# EAGLE board core (EAGLE 9.4.2), part 1 of 6
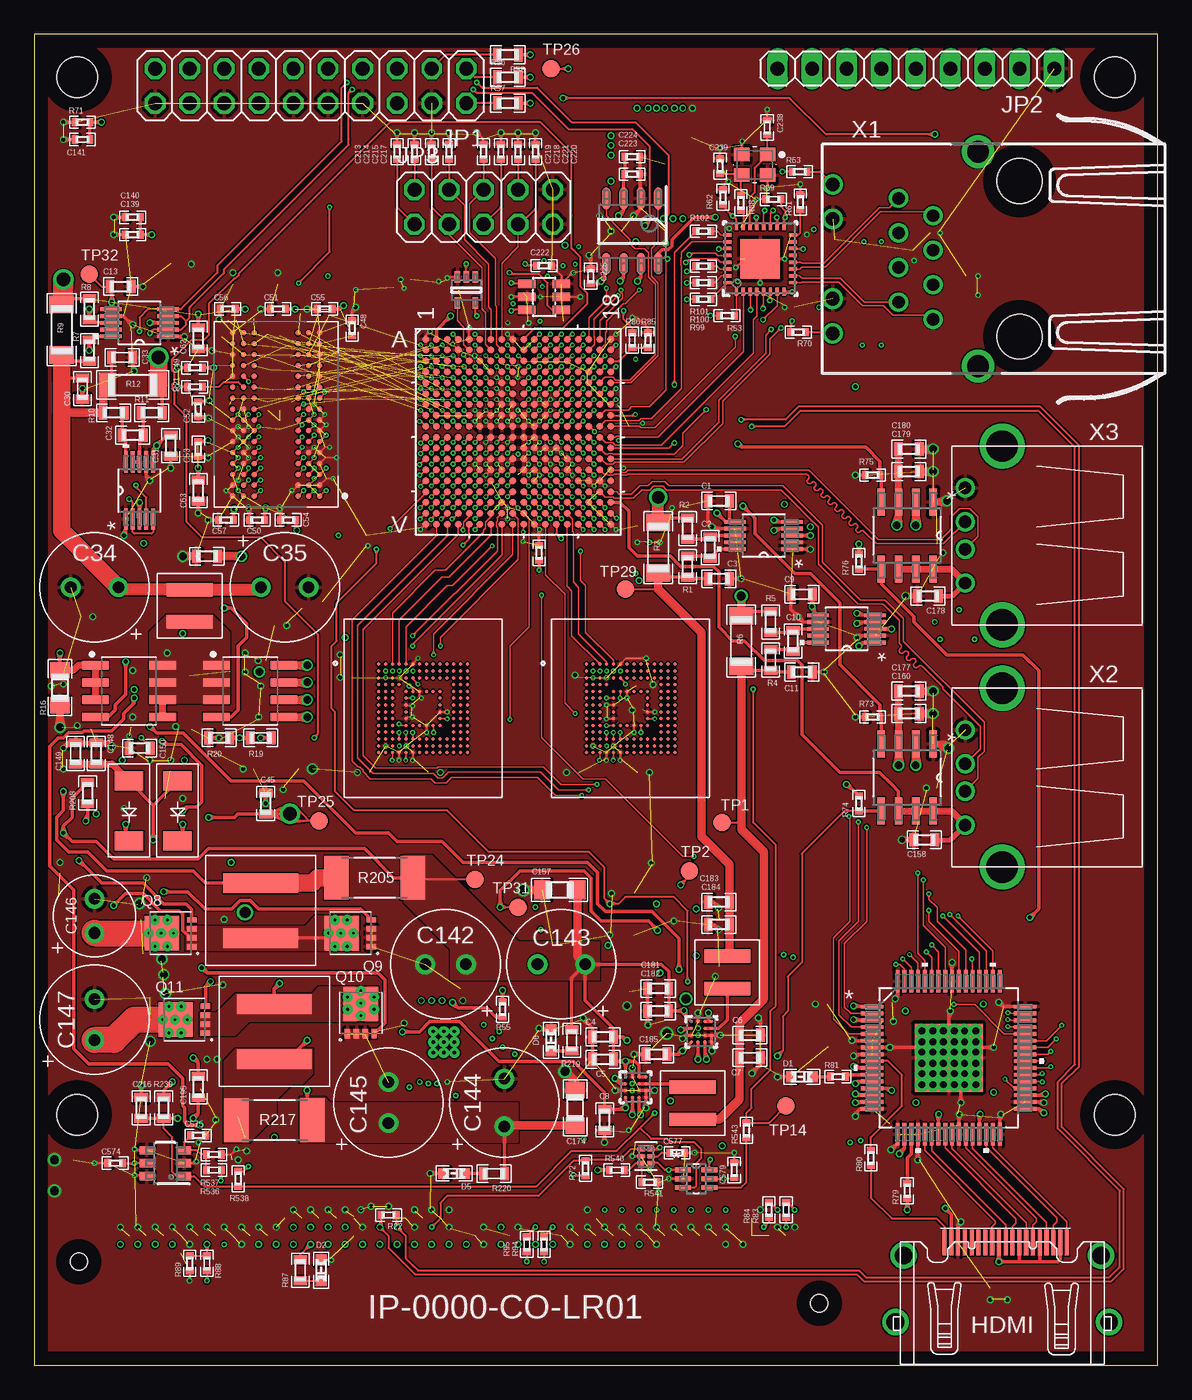
[diagram p16: board, top side]
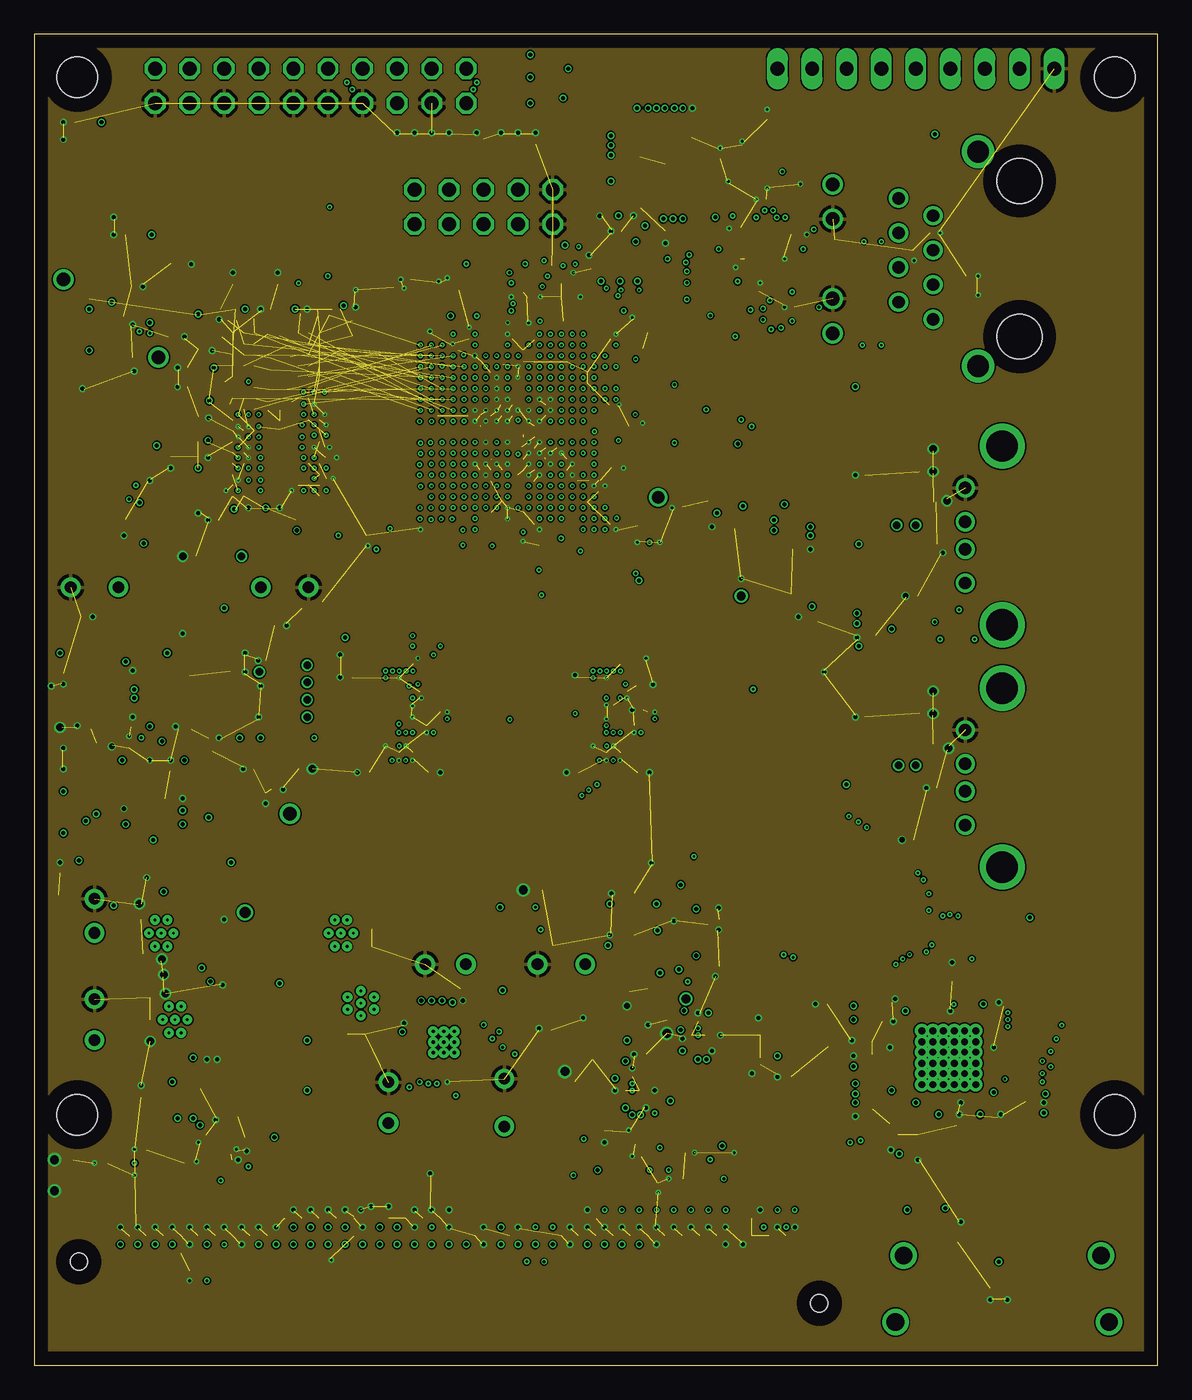
[diagram p17: board, inner layer Route2]
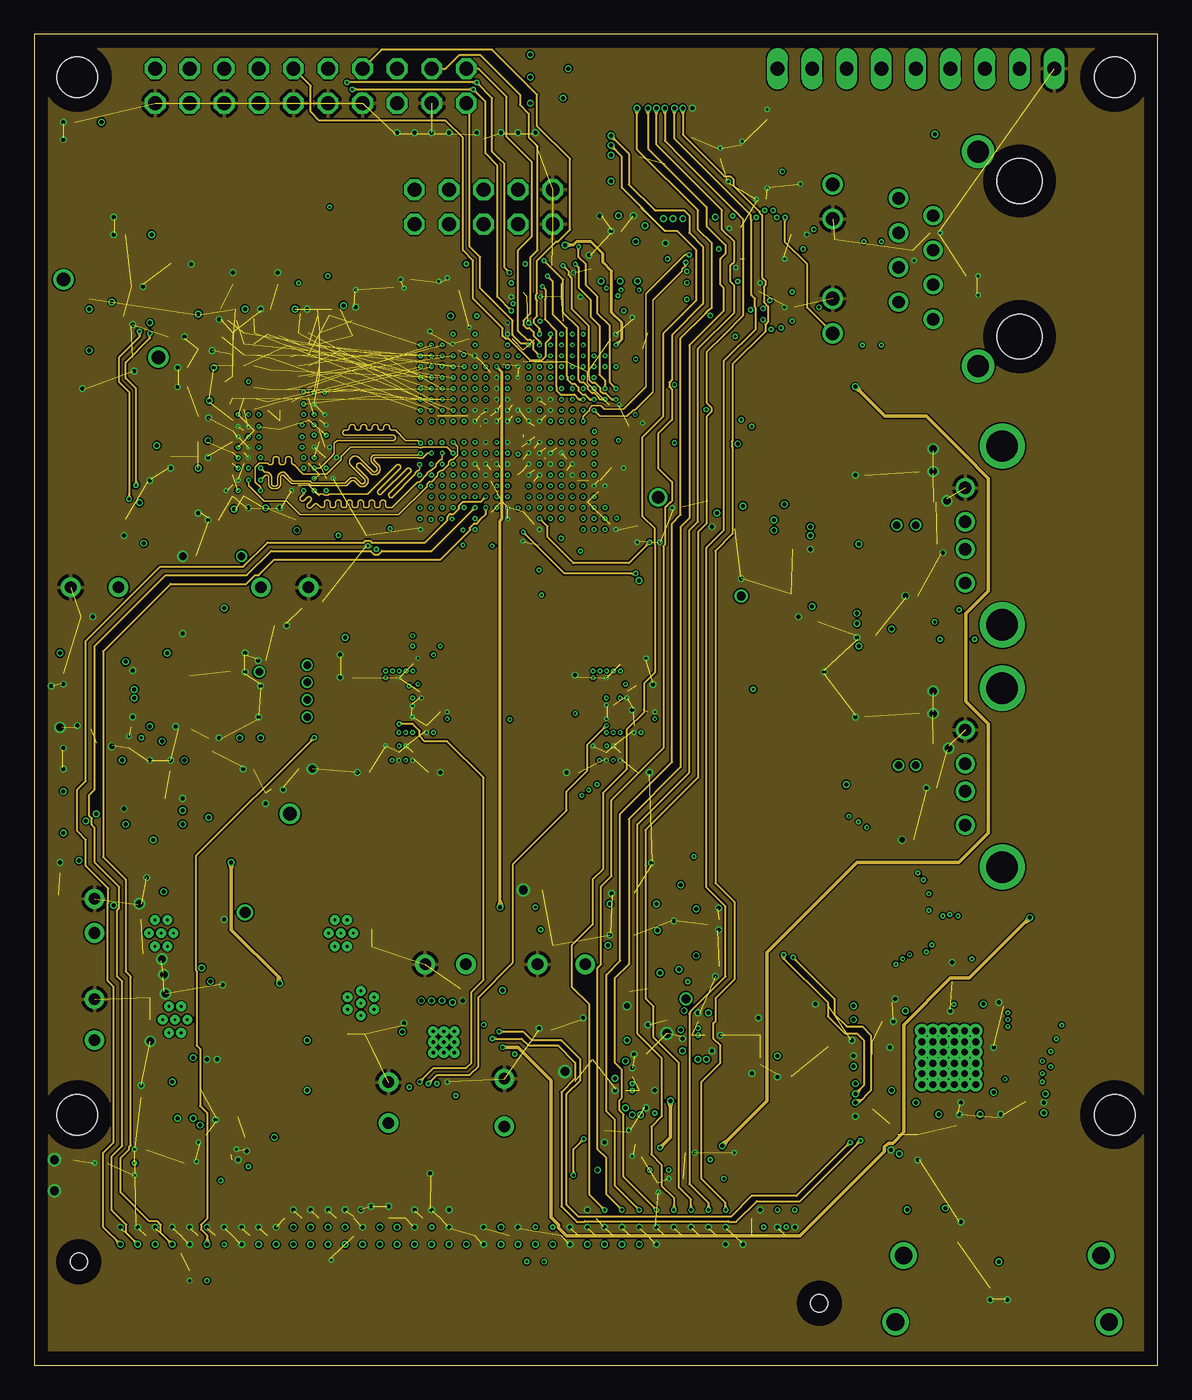
[diagram p18: board, inner layer Route3]
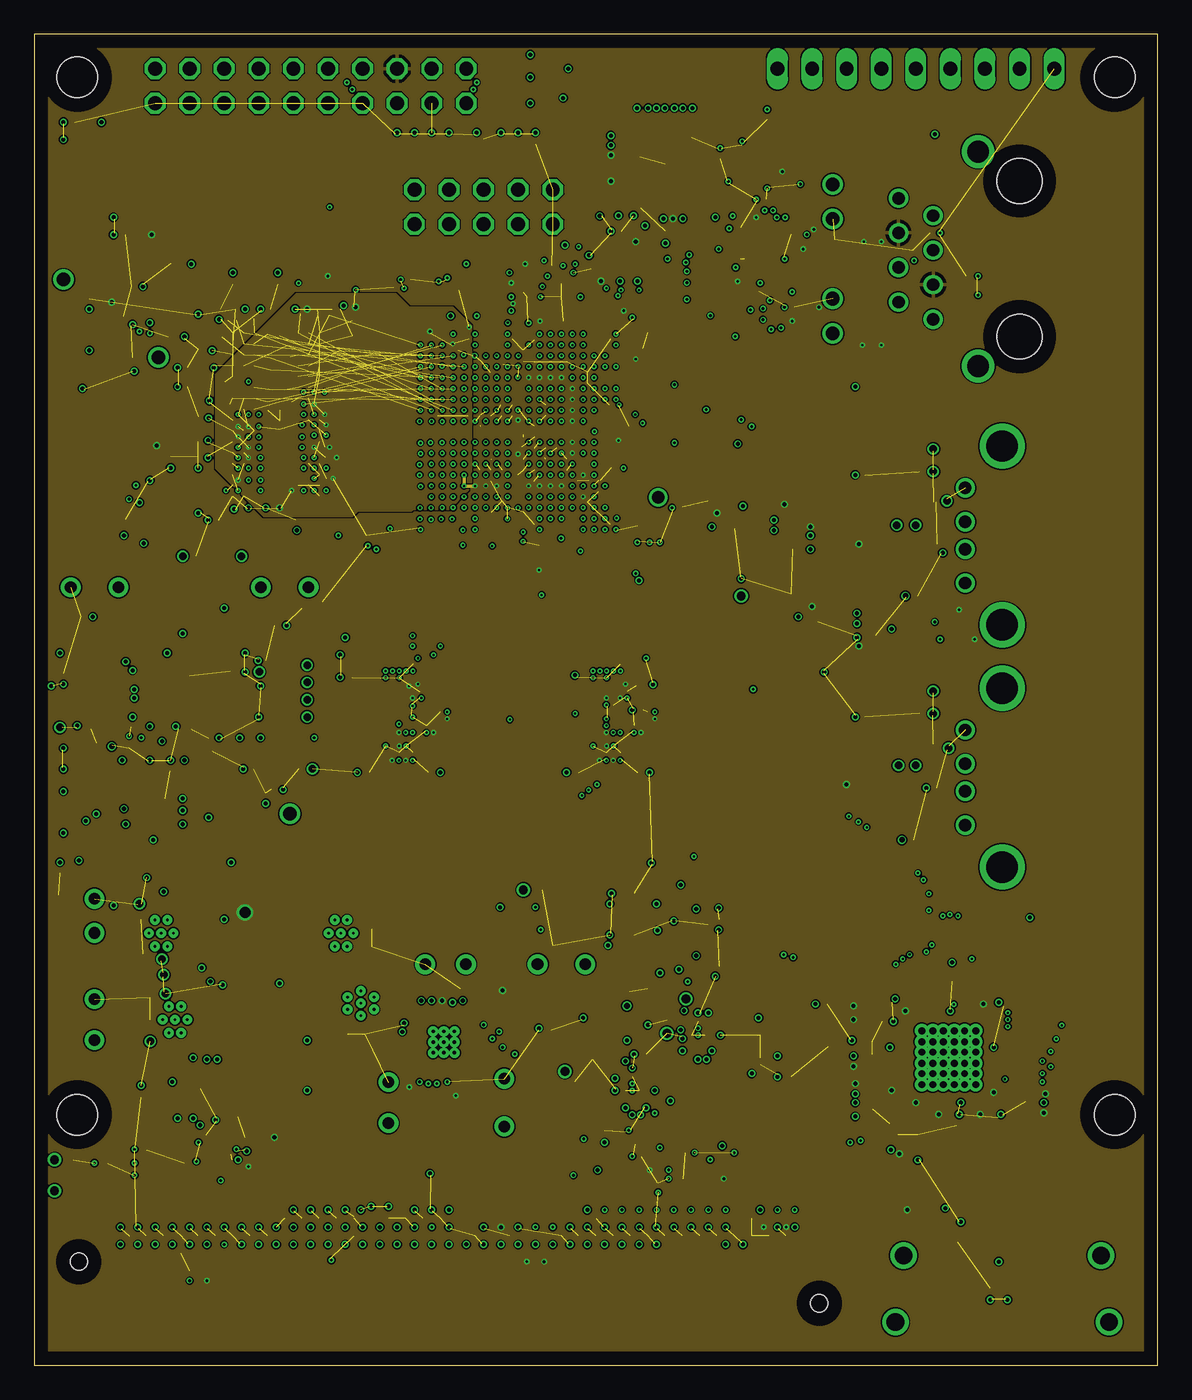
[diagram p19: board, inner layer Route4]
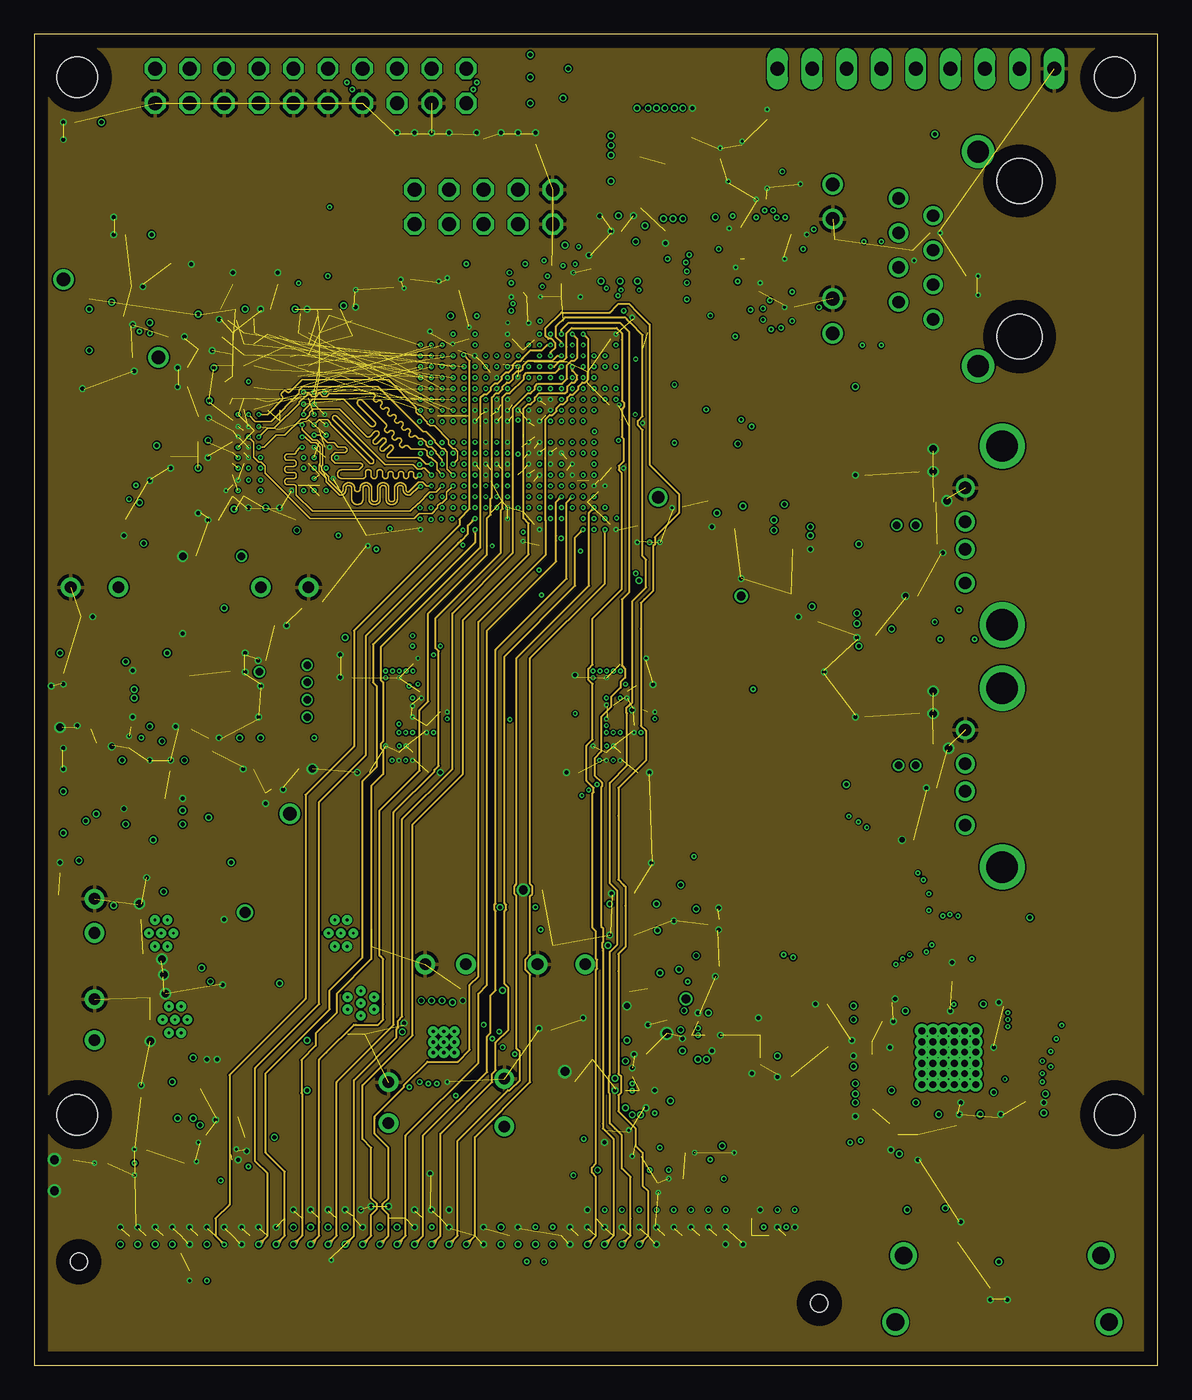
[diagram p20: board, inner layer Route5]
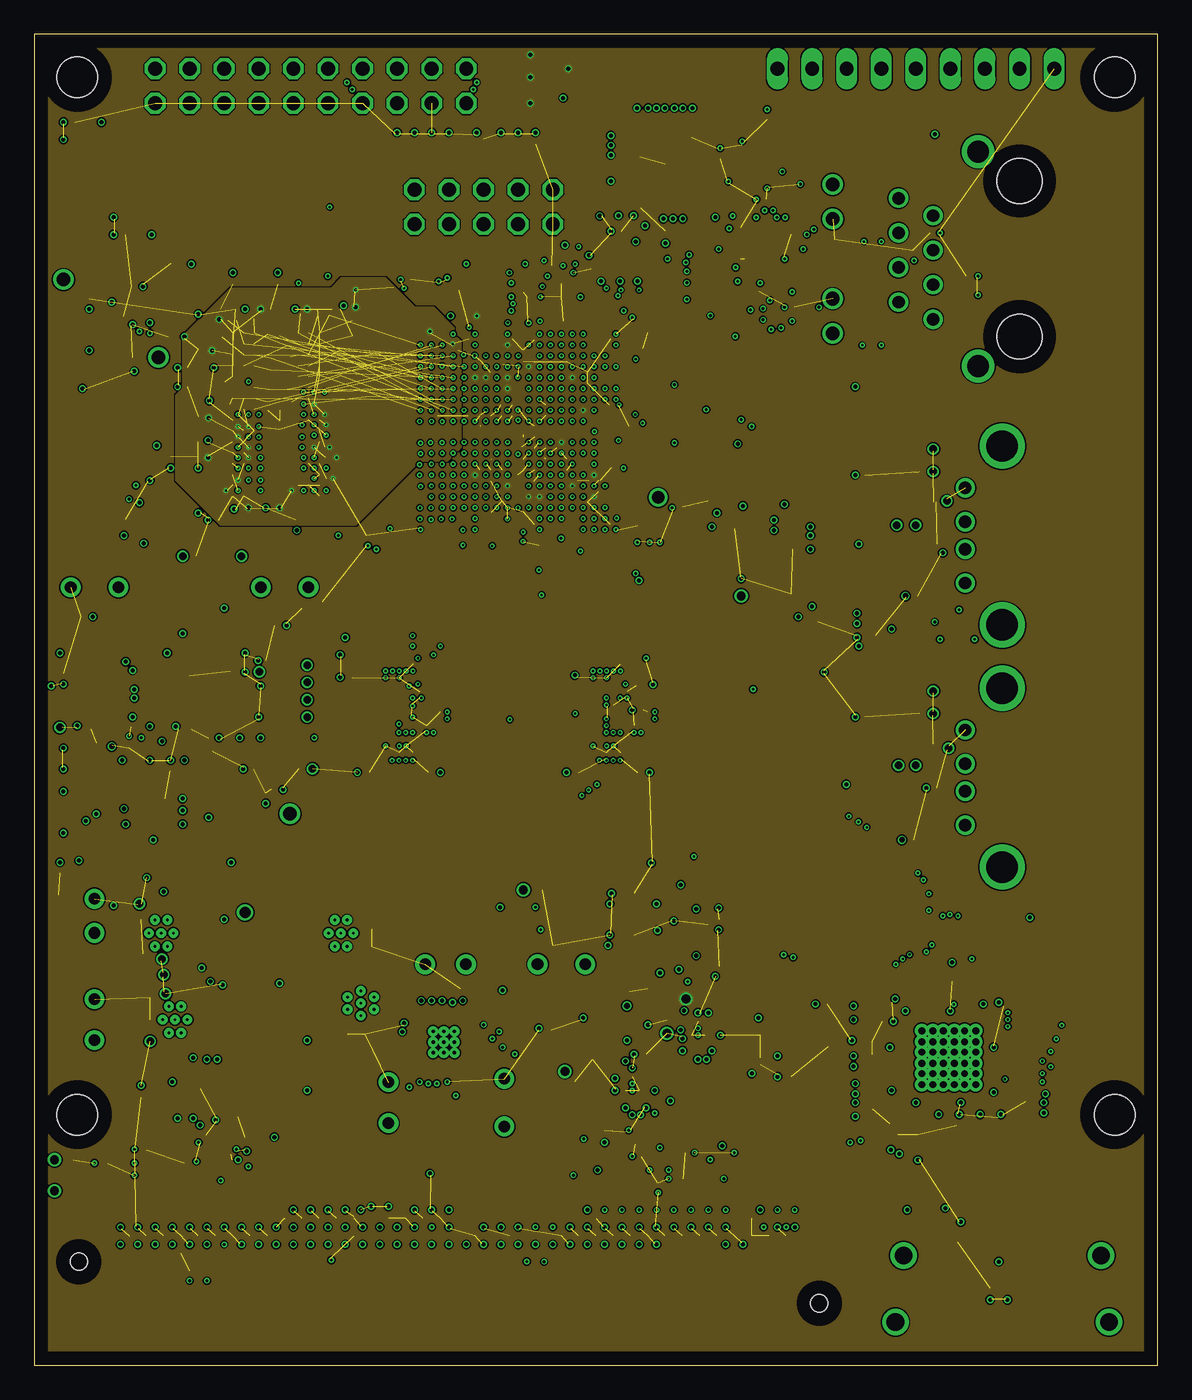
[diagram p21: board, inner layer Route12]
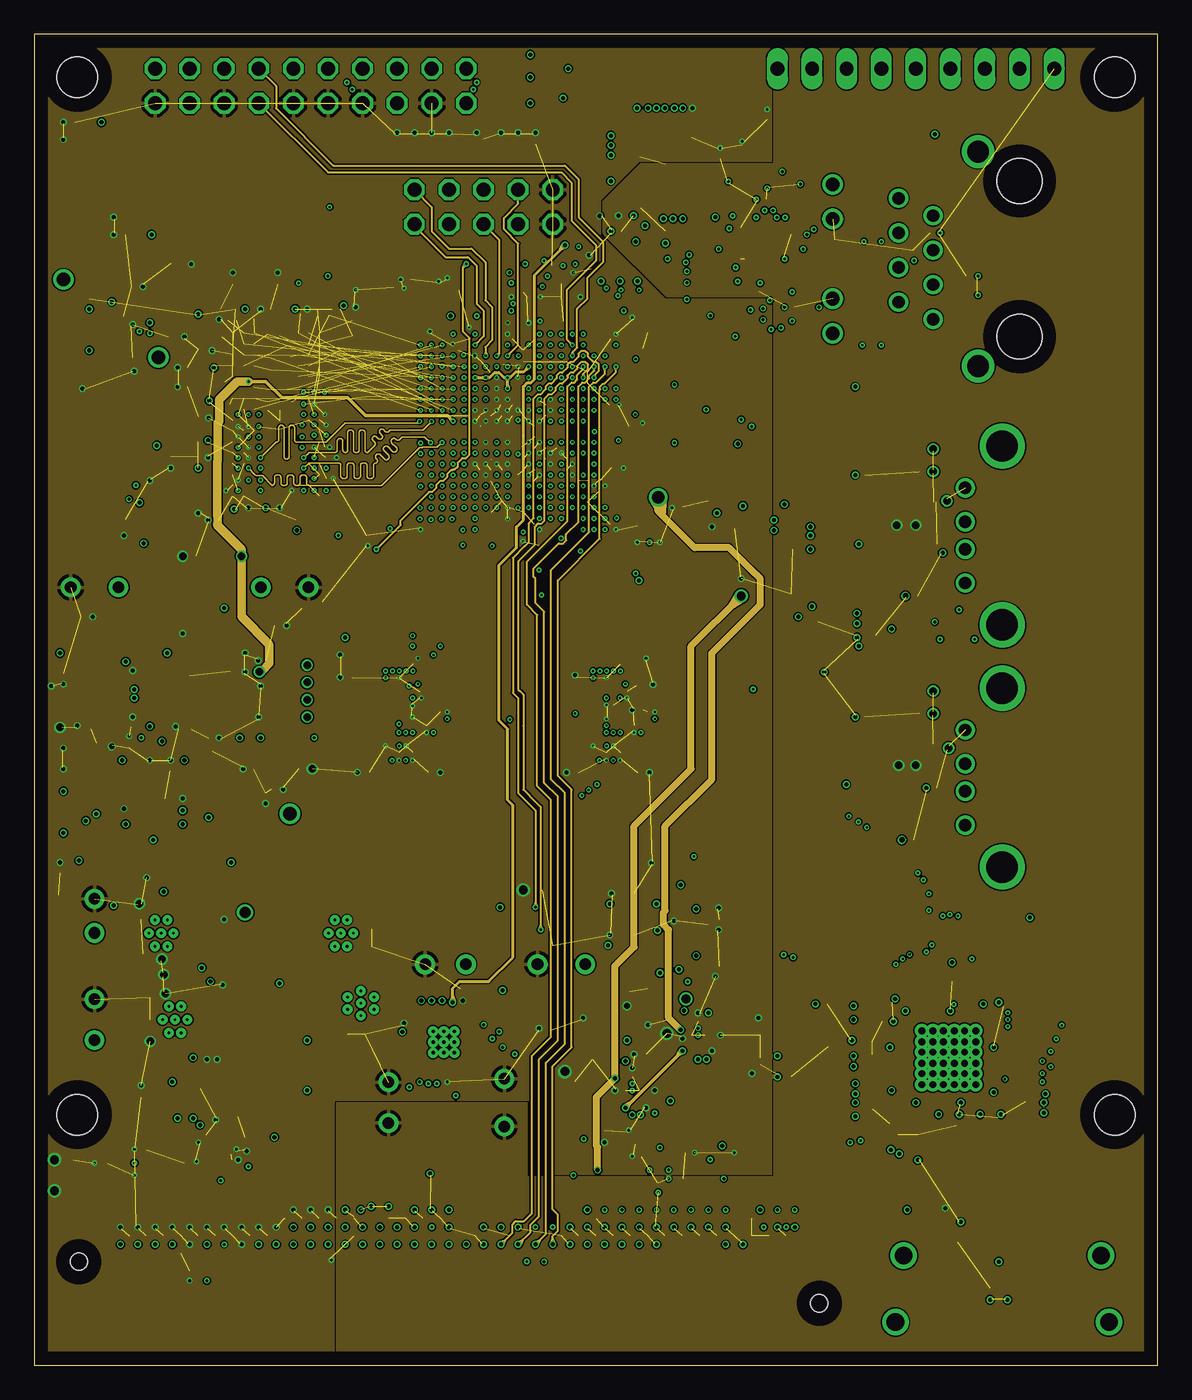
[diagram p22: board, inner layer Route13]
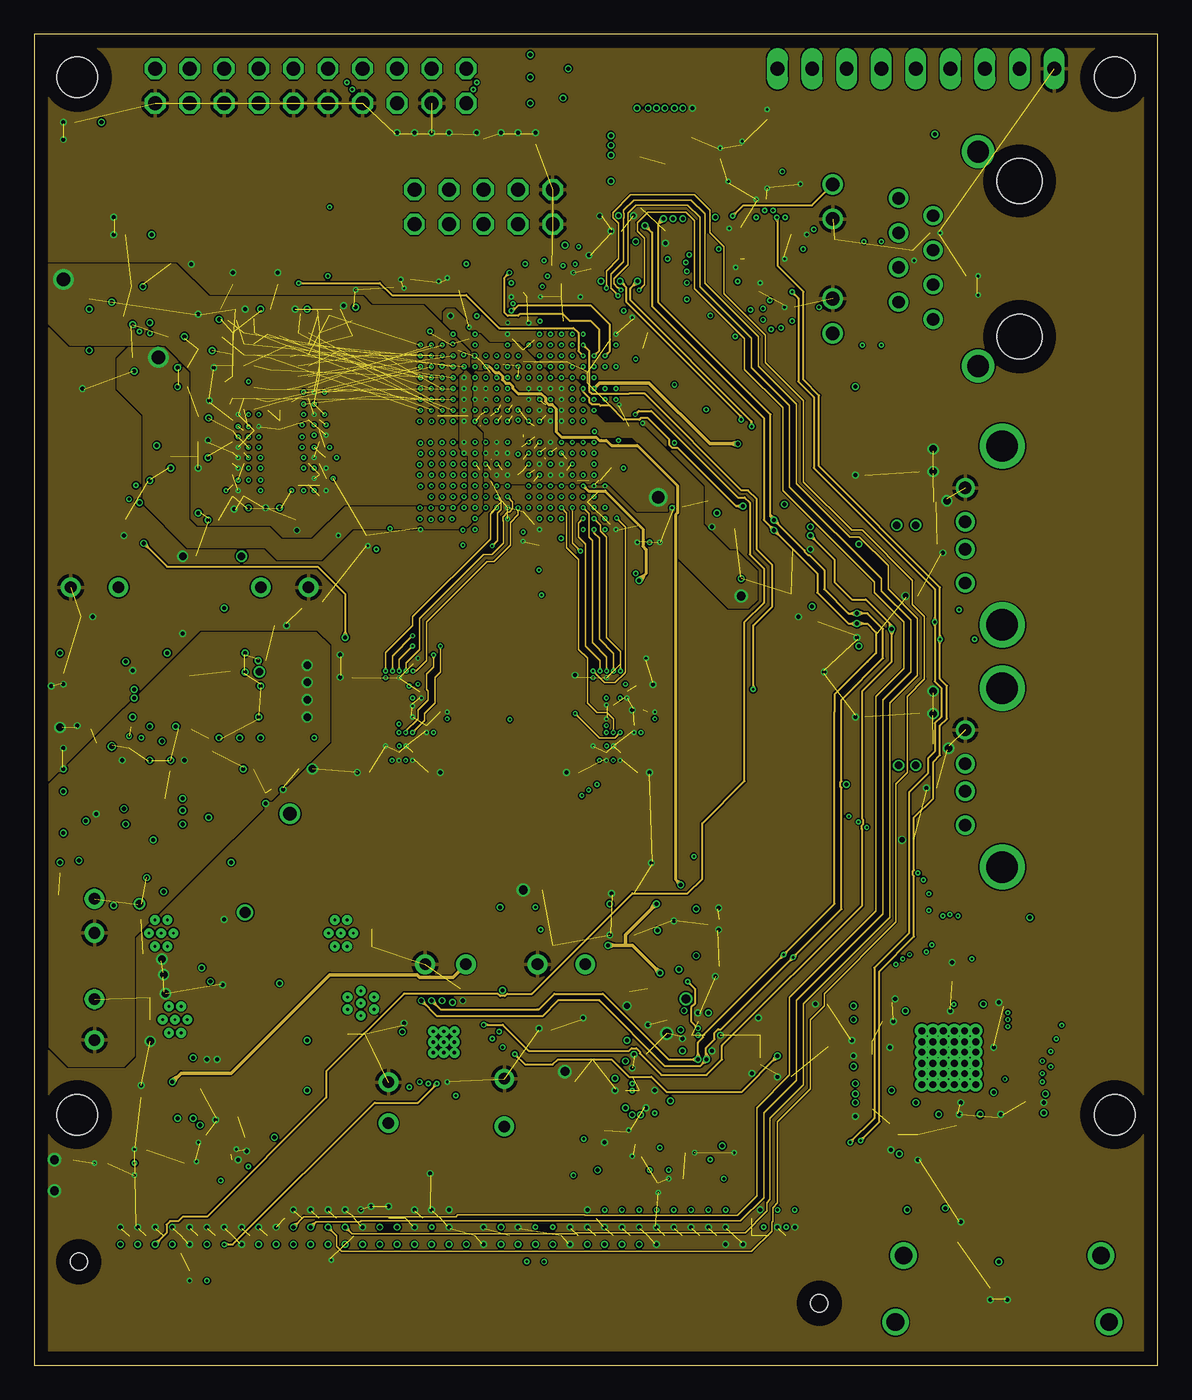
[diagram p23: board, inner layer Route14]
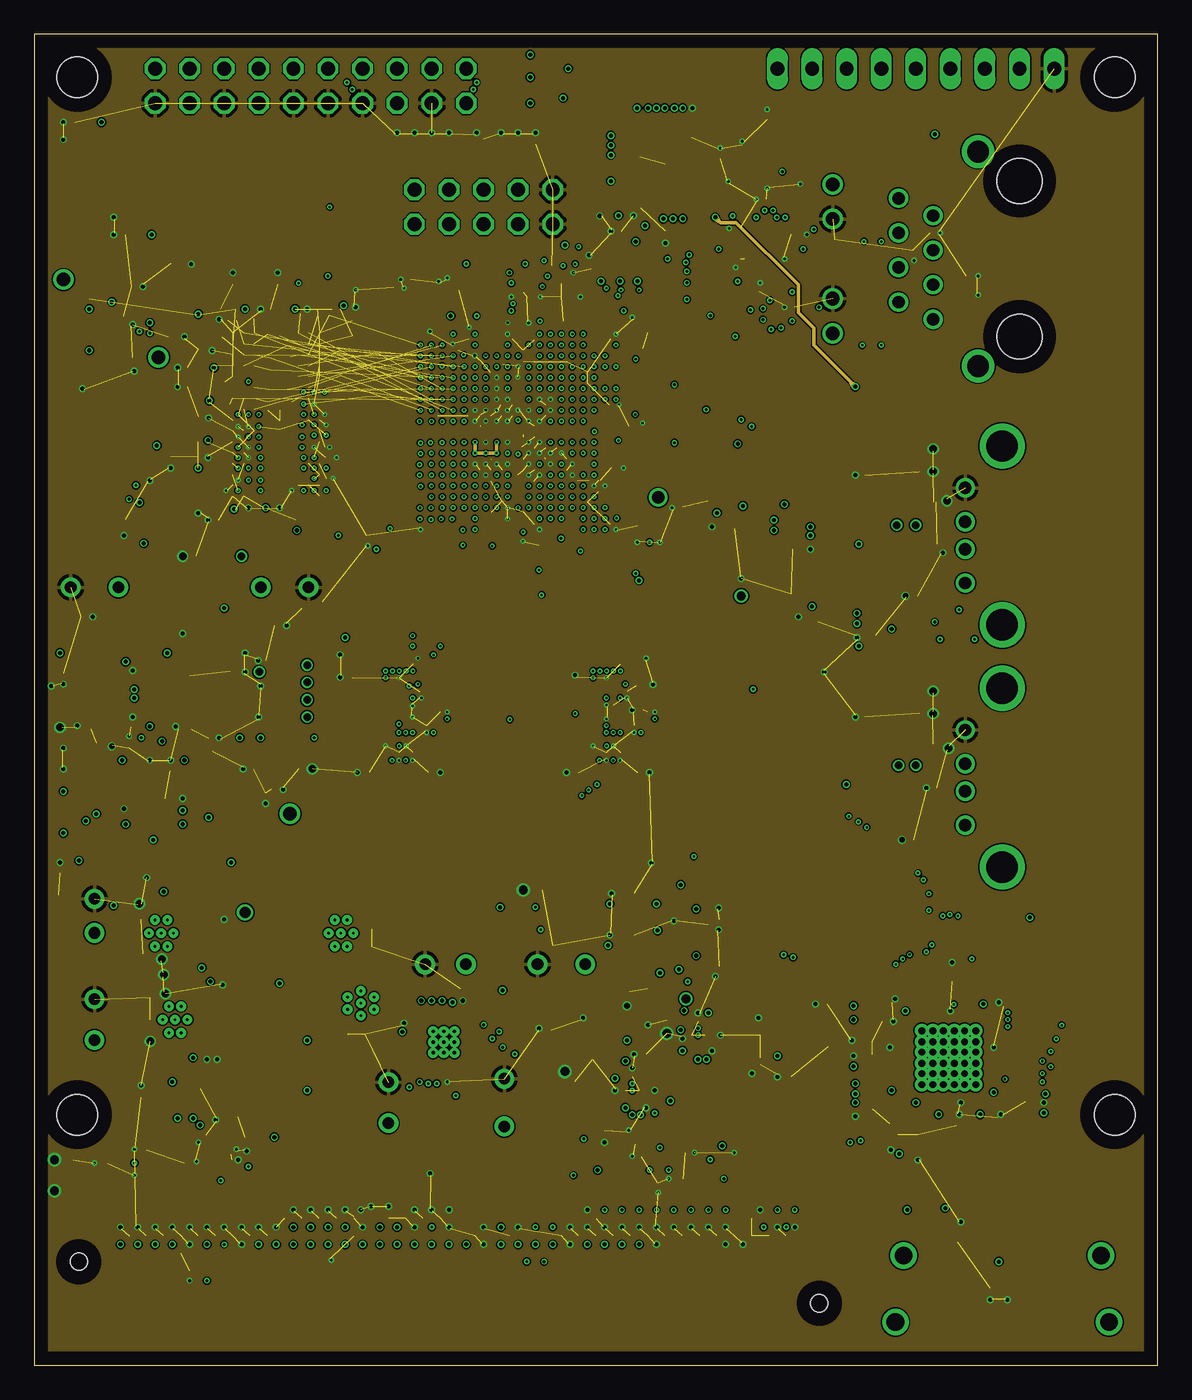
[diagram p24: board, inner layer Route15]
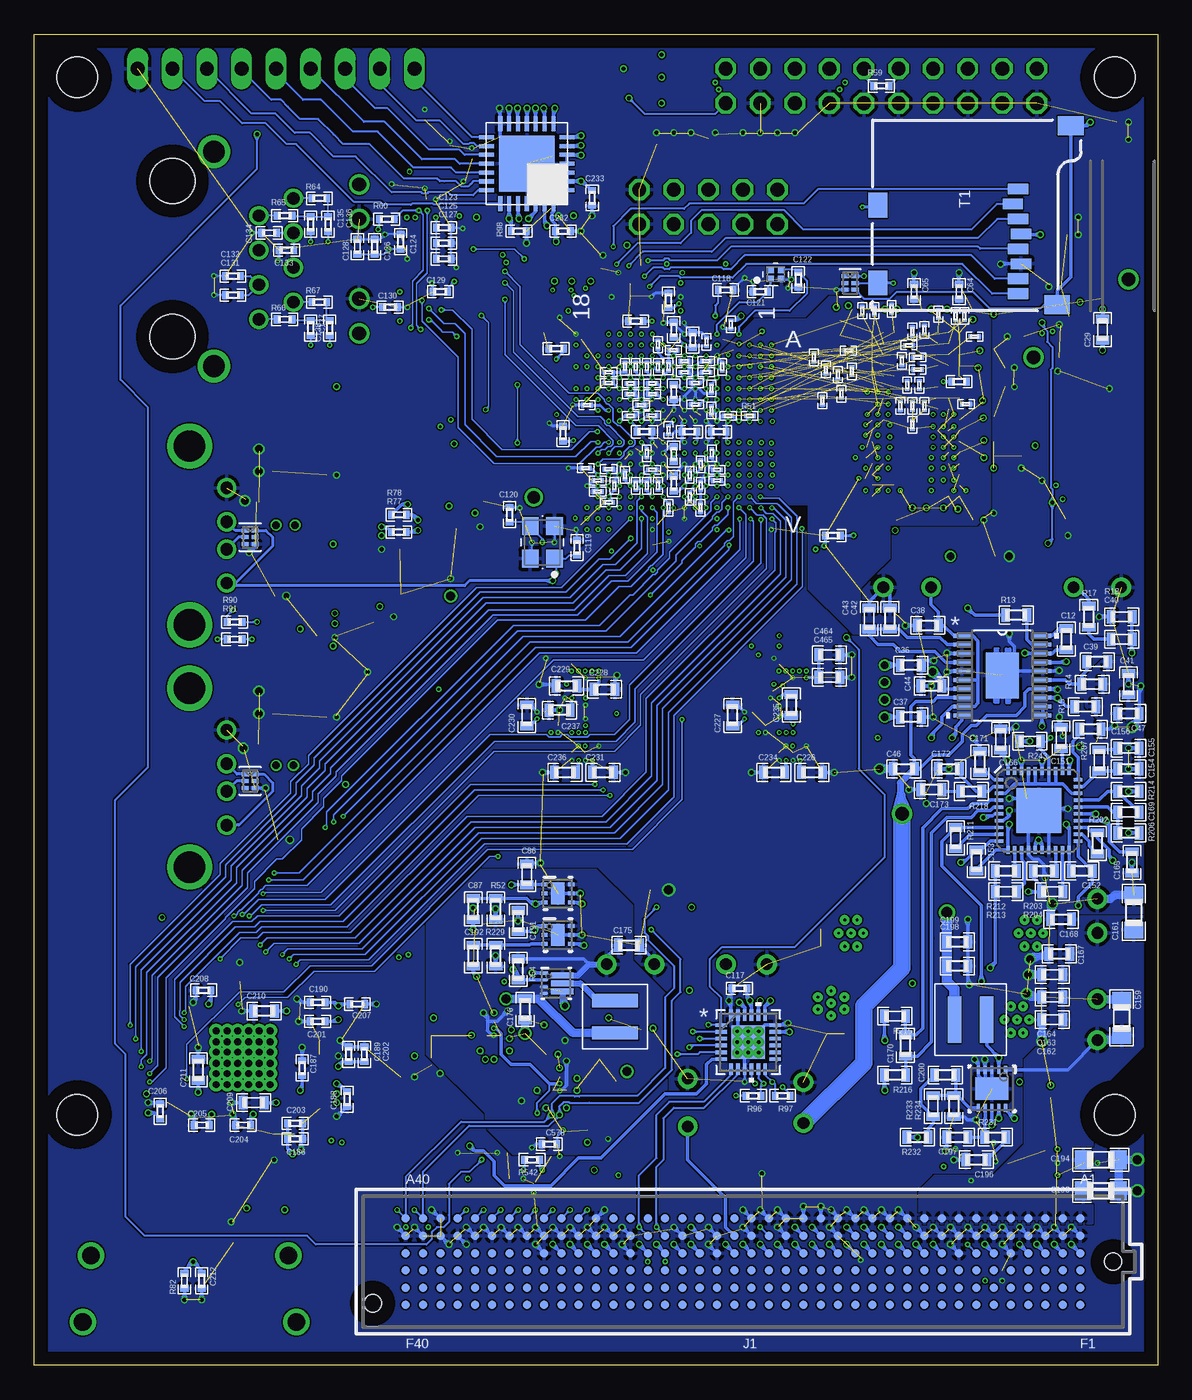
[diagram p25: board, bottom side, seen from below]

Size 82.55 x 97.79 mm. Coordinates in mm from the lower left corner, seen from the top.
Outline: 0,0 82.55,0 82.55,97.79 0,97.79 0,0
Copper layers (1+2*3+4*5+12*13+14*15+16): Top 0.035mm / dielectric 0.1mm / Route2 0.035mm / dielectric 0.22mm / Route3 0.035mm / dielectric 0.25mm / Route4 0.035mm / dielectric 0.15mm / Route5 0.035mm / dielectric 0.2mm / Route12 0.035mm / dielectric 0.15mm / Route13 0.035mm / dielectric 0.25mm / Route14 0.035mm / dielectric 0.22mm / Route15 0.035mm / dielectric 0.1mm / Bottom 0.035mm
Design rules "default *": minimum track width 4mil, minimum drill 0.15mm, track to track 4mil, track to pad 3.5mil, pad to pad 4mil, via to via 4mil, smd to smd 0mil, copper to edge 40mil, drill to drill 6mil, minimum pad ring 10mil, minimum via ring 4mil, stop-mask expansion 4mil, vias tented up to drill 0mil, thermal gap 10mil
Net classes: 1 6mil: width 0.152 mm, clearance 0.152 mm; 2 5mil: width 0.127 mm, clearance 0.127 mm
Holes 3 mm at 3.17,94.61 79.38,94.61 79.38,18.41 3.17,18.41

## Footprints (pad centres in the part's own frame; a part is rotated, then mirrored left to right if it is on the bottom)
0603 = smd 0.65 x 1: 1 -0.775,0; 2 0.775,0
0402 = smd 0.5 x 0.6: 1 -0.55,0; 2 0.55,0
0201 = smd 0.25 x 0.35: 1 -0.325,0; 2 0.325,0
CAPPRD350W65D800H1500B = drill 0.85 pad 1.45: 1 -1.75,0; 2 1.75,0
CAPPRD300W65D800H1200B = drill 0.85 pad 1.45: 1 -1.5,0; 2 1.5,0
CAPPRD250W65D600H1100B = drill 0.85 pad 1.45: 1 -1.25,0; 2 1.25,0
0805 = smd 1.2 x 1.4: 1 -1.3,0; 2 1.3,0
0603.LED = smd 0.8 x 0.8: P$1 -0.775,0; P$2 0.775,0
HDMI_A = smd 0.3 x 1.9: P$1 4.75,3.95; P$2 4.25,3.95; P$3 3.75,3.95; P$4 3.25,3.95; P$5 2.75,3.95; P$6 2.25,3.95; P$7 1.75,3.95; P$8 1.25,3.95; P$9 0.75,3.95; P$10 0.25,3.95; P$11 -0.25,3.95; P$12 -0.75,3.95; P$13 -1.25,3.95; P$14 -1.75,3.95; P$15 -2.25,3.95; P$16 -2.75,3.95; P$17 -3.25,3.95; P$18 -3.75,3.95; P$19 -4.25,3.95 | drill 1.3: P$20 -7.25,3; P$21 7.25,3; P$22 7.85,-1.9; P$23 -7.85,-1.9
SEAM-40-XX.X-XX-06-X-A = smd 0.635 x 0.635: A1 24.765,3.175; A2 23.495,3.175; A3 22.225,3.175; A4 20.955,3.175; A5 19.685,3.175; A6 18.415,3.175; A7 17.145,3.175; A8 15.875,3.175; A9 14.605,3.175; A10 13.335,3.175; A11 12.065,3.175; A12 10.795,3.175; A13 9.525,3.175; A14 8.255,3.175; A15 6.985,3.175; A16 5.715,3.175; A17 4.445,3.175; A18 3.175,3.175; A19 1.905,3.175; A20 0.635,3.175; A21 -0.635,3.175; A22 -1.905,3.175; A23 -3.175,3.175; A24 -4.445,3.175; A25 -5.715,3.175; A26 -6.985,3.175; A27 -8.255,3.175; A28 -9.525,3.175; A29 -10.795,3.175; A30 -12.065,3.175; A31 -13.335,3.175; A32 -14.605,3.175; A33 -15.875,3.175; A34 -17.145,3.175; A35 -18.415,3.175; A36 -19.685,3.175; A37 -20.955,3.175; A38 -22.225,3.175; A39 -23.495,3.175; A40 -24.765,3.175; B1 24.765,1.905; B2 23.495,1.905; B3 22.225,1.905; B4 20.955,1.905; B5 19.685,1.905; B6 18.415,1.905; B7 17.145,1.905; B8 15.875,1.905; B9 14.605,1.905; B10 13.335,1.905; B11 12.065,1.905; B12 10.795,1.905; B13 9.525,1.905; B14 8.255,1.905; B15 6.985,1.905; B16 5.715,1.905; B17 4.445,1.905; B18 3.175,1.905; B19 1.905,1.905; B20 0.635,1.905; B21 -0.635,1.905; B22 -1.905,1.905; B23 -3.175,1.905; B24 -4.445,1.905; B25 -5.715,1.905; B26 -6.985,1.905; B27 -8.255,1.905; B28 -9.525,1.905; B29 -10.795,1.905; B30 -12.065,1.905; B31 -13.335,1.905; B32 -14.605,1.905; B33 -15.875,1.905; B34 -17.145,1.905; B35 -18.415,1.905; B36 -19.685,1.905; B37 -20.955,1.905; B38 -22.225,1.905; B39 -23.495,1.905; B40 -24.765,1.905; C1 24.765,0.635; C2 23.495,0.635; C3 22.225,0.635; C4 20.955,0.635; C5 19.685,0.635; C6 18.415,0.635; C7 17.145,0.635; C8 15.875,0.635; C9 14.605,0.635; C10 13.335,0.635; C11 12.065,0.635; C12 10.795,0.635; C13 9.525,0.635; C14 8.255,0.635; C15 6.985,0.635; C16 5.715,0.635; C17 4.445,0.635; C18 3.175,0.635; C19 1.905,0.635; C20 0.635,0.635; C21 -0.635,0.635; C22 -1.905,0.635; C23 -3.175,0.635; C24 -4.445,0.635; C25 -5.715,0.635; C26 -6.985,0.635; C27 -8.255,0.635; C28 -9.525,0.635; C29 -10.795,0.635; C30 -12.065,0.635; C31 -13.335,0.635; C32 -14.605,0.635; C33 -15.875,0.635; C34 -17.145,0.635; C35 -18.415,0.635; C36 -19.685,0.635; C37 -20.955,0.635; C38 -22.225,0.635; C39 -23.495,0.635; C40 -24.765,0.635; D1 24.765,-0.635; D2 23.495,-0.635; D3 22.225,-0.635; D4 20.955,-0.635; D5 19.685,-0.635; D6 18.415,-0.635; D7 17.145,-0.635; D8 15.875,-0.635; D9 14.605,-0.635; D10 13.335,-0.635; D11 12.065,-0.635; D12 10.795,-0.635; D13 9.525,-0.635; D14 8.255,-0.635; D15 6.985,-0.635; D16 5.715,-0.635; D17 4.445,-0.635; D18 3.175,-0.635; D19 1.905,-0.635; D20 0.635,-0.635; D21 -0.635,-0.635; D22 -1.905,-0.635; D23 -3.175,-0.635; D24 -4.445,-0.635; D25 -5.715,-0.635; D26 -6.985,-0.635; D27 -8.255,-0.635; D28 -9.525,-0.635; D29 -10.795,-0.635; D30 -12.065,-0.635; D31 -13.335,-0.635; D32 -14.605,-0.635; D33 -15.875,-0.635; D34 -17.145,-0.635; D35 -18.415,-0.635; D36 -19.685,-0.635; D37 -20.955,-0.635; D38 -22.225,-0.635; D39 -23.495,-0.635; D40 -24.765,-0.635; E1 24.765,-1.905; E2 23.495,-1.905; E3 22.225,-1.905; E4 20.955,-1.905; E5 19.685,-1.905; E6 18.415,-1.905; E7 17.145,-1.905; E8 15.875,-1.905; E9 14.605,-1.905; E10 13.335,-1.905; E11 12.065,-1.905; E12 10.795,-1.905; E13 9.525,-1.905; E14 8.255,-1.905; E15 6.985,-1.905; E16 5.715,-1.905; E17 4.445,-1.905; E18 3.175,-1.905; E19 1.905,-1.905; E20 0.635,-1.905; E21 -0.635,-1.905; E22 -1.905,-1.905; E23 -3.175,-1.905; E24 -4.445,-1.905; E25 -5.715,-1.905; E26 -6.985,-1.905; E27 -8.255,-1.905; E28 -9.525,-1.905; E29 -10.795,-1.905; E30 -12.065,-1.905; E31 -13.335,-1.905; E32 -14.605,-1.905; E33 -15.875,-1.905; E34 -17.145,-1.905; E35 -18.415,-1.905; E36 -19.685,-1.905; E37 -20.955,-1.905; E38 -22.225,-1.905; E39 -23.495,-1.905; E40 -24.765,-1.905; F1 24.765,-3.175; F2 23.495,-3.175; F3 22.225,-3.175; F4 20.955,-3.175; F5 19.685,-3.175; F6 18.415,-3.175; F7 17.145,-3.175; F8 15.875,-3.175; F9 14.605,-3.175; F10 13.335,-3.175; F11 12.065,-3.175; F12 10.795,-3.175; F13 9.525,-3.175; F14 8.255,-3.175; F15 6.985,-3.175; F16 5.715,-3.175; F17 4.445,-3.175; F18 3.175,-3.175; F19 1.905,-3.175; F20 0.635,-3.175; F21 -0.635,-3.175; F22 -1.905,-3.175; F23 -3.175,-3.175; F24 -4.445,-3.175; F25 -5.715,-3.175; F26 -6.985,-3.175; F27 -8.255,-3.175; F28 -9.525,-3.175; F29 -10.795,-3.175; F30 -12.065,-3.175; F31 -13.335,-3.175; F32 -14.605,-3.175; F33 -15.875,-3.175; F34 -17.145,-3.175; F35 -18.415,-3.175; F36 -19.685,-3.175; F37 -20.955,-3.175; F38 -22.225,-3.175; F39 -23.495,-3.175; F40 -24.765,-3.175 | hole 1.27: 27.191,0; -27.191,-3.048
2X10 = drill 1.016 octagon: 1 -11.43,-1.27; 2 -11.43,1.27; 3 -8.89,-1.27; 4 -8.89,1.27; 5 -6.35,-1.27; 6 -6.35,1.27; 7 -3.81,-1.27; 8 -3.81,1.27; 9 -1.27,-1.27; 10 -1.27,1.27; 11 1.27,-1.27; 12 1.27,1.27; 13 3.81,-1.27; 14 3.81,1.27; 15 6.35,-1.27; 16 6.35,1.27; 17 8.89,-1.27; 18 8.89,1.27; 19 11.43,-1.27; 20 11.43,1.27
1X09 = drill 1.016 long: 1 -10.16,0; 2 -7.62,0; 3 -5.08,0; 4 -2.54,0; 5 0,0; 6 2.54,0; 7 5.08,0; 8 7.62,0; 9 10.16,0
2X05 = drill 1.016 octagon: 1 -5.08,-1.27; 2 -5.08,1.27; 3 -2.54,-1.27; 4 -2.54,1.27; 5 0,-1.27; 6 0,1.27; 7 2.54,-1.27; 8 2.54,1.27; 9 5.08,-1.27; 10 5.08,1.27
SON65P300X315X90-9N = smd 0.7 x 0.4: 1 -1.55,0.975; 2 -1.55,0.325; 3 -1.55,-0.325; 4 -1.55,-0.975 | smd 2.51 x 2.55: 5-9 0.645,0 | drill 0.2 pad 0.25: P$6 -0.207,0; P$7 0.698,0; P$8 1.603,0; P$9 1.15,0.975; P$10 0.245,0.975; P$11 0.245,-0.975; P$12 1.15,-0.975
1206 = smd 1.3 x 1.8: 1 -1.85,0; 2 1.85,0
R2512 = smd 1.8 x 3.2: 1 -2.8,0; 2 2.8,0
MICRO-SD-SOCKET-PP = smd 0.8 x 1.5: 1 -8.94,10.7; 2 -7.84,10.3; 3 -6.74,10.7; 4 -5.64,10.9; 5 -4.54,10.7; 6 -3.44,10.9; 7 -2.34,10.7; 8 -1.24,10.7 | smd 1.8 x 1.4: CD1 -2.05,0.4; CD2 -7.75,0.4 | smd 1.4 x 1.9: GND1 -13.6,14.55; GND3 -0.45,13.55
TESTPAD_B1,27 = smd 1.27 x 1.27: TP 0,0
ZCZ324 = smd 0.508 x 0.508: A1 -6.8,6.8; A2 -6,6.8; A3 -5.2,6.8; A4 -4.4,6.8; A5 -3.6,6.8; A6 -2.8,6.8; A7 -2,6.8; A8 -1.2,6.8; A9 -0.4,6.8; A10 0.4,6.8; A11 1.2,6.8; A12 2,6.8; A13 2.8,6.8; A14 3.6,6.8; A15 4.4,6.8; A16 5.2,6.8; A17 6,6.8; A18 6.8,6.8; B1 -6.8,6; B2 -6,6; B3 -5.2,6; B4 -4.4,6; B5 -3.6,6; B6 -2.8,6; B7 -2,6; B8 -1.2,6; B9 -0.4,6; B10 0.4,6; B11 1.2,6; B12 2,6; B13 2.8,6; B14 3.6,6; B15 4.4,6; B16 5.2,6; B17 6,6; B18 6.8,6; C1 -6.8,5.2; C2 -6,5.2; C3 -5.2,5.2; C4 -4.4,5.2; C5 -3.6,5.2; C6 -2.8,5.2; C7 -2,5.2; C8 -1.2,5.2; C9 -0.4,5.2; C10 0.4,5.2; C11 1.2,5.2; C12 2,5.2; C13 2.8,5.2; C14 3.6,5.2; C15 4.4,5.2; C16 5.2,5.2; C17 6,5.2; C18 6.8,5.2; D1 -6.8,4.4; D2 -6,4.4; D3 -5.2,4.4; D4 -4.4,4.4; D5 -3.6,4.4; D6 -2.8,4.4; D7 -2,4.4; D8 -1.2,4.4; D9 -0.4,4.4; D10 0.4,4.4; D11 1.2,4.4; D12 2,4.4; D13 2.8,4.4; D14 3.6,4.4; D15 4.4,4.4; D16 5.2,4.4; D17 6,4.4; D18 6.8,4.4; E1 -6.8,3.6; E2 -6,3.6; E3 -5.2,3.6; E4 -4.4,3.6; E5 -3.6,3.6; E6 -2.8,3.6; E7 -2,3.6; E8 -1.2,3.6; E9 -0.4,3.6; E10 0.4,3.6; E11 1.2,3.6; E12 2,3.6; E13 2.8,3.6; E14 3.6,3.6; E15 4.4,3.6; E16 5.2,3.6; E17 6,3.6; E18 6.8,3.6; F1 -6.8,2.8; F2 -6,2.8; F3 -5.2,2.8; F4 -4.4,2.8; F5 -3.6,2.8; F6 -2.8,2.8; F7 -2,2.8; F8 -1.2,2.8; F9 -0.4,2.8; F10 0.4,2.8; F11 1.2,2.8; F12 2,2.8; F13 2.8,2.8; F14 3.6,2.8; F15 4.4,2.8; F16 5.2,2.8; F17 6,2.8; F18 6.8,2.8; G1 -6.8,2; G2 -6,2; G3 -5.2,2; G4 -4.4,2; G5 -3.6,2; G6 -2.8,2; G7 -2,2; G8 -1.2,2; G9 -0.4,2; G10 0.4,2; G11 1.2,2; G12 2,2; G13 2.8,2; G14 3.6,2; G15 4.4,2; G16 5.2,2; G17 6,2; G18 6.8,2; H1 -6.8,1.2; H2 -6,1.2; H3 -5.2,1.2; H4 -4.4,1.2; H5 -3.6,1.2; H6 -2.8,1.2; H7 -2,1.2; H8 -1.2,1.2; H9 -0.4,1.2; H10 0.4,1.2; H11 1.2,1.2; H12 2,1.2; H13 2.8,1.2; H14 3.6,1.2; H15 4.4,1.2; H16 5.2,1.2; H17 6,1.2; H18 6.8,1.2; J1 -6.8,0.4; J2 -6,0.4; J3 -5.2,0.4; J4 -4.4,0.4; J5 -3.6,0.4; J6 -2.8,0.4; J7 -2,0.4; J8 -1.2,0.4; J9 -0.4,0.4; J10 0.4,0.4; J11 1.2,0.4; J12 2,0.4; J13 2.8,0.4; J14 3.6,0.4; J15 4.4,0.4; J16 5.2,0.4; J17 6,0.4; J18 6.8,0.4; K1 -6.8,-0.4; K2 -6,-0.4; K3 -5.2,-0.4; K4 -4.4,-0.4; K5 -3.6,-0.4; K6 -2.8,-0.4; K7 -2,-0.4; K8 -1.2,-0.4; K9 -0.4,-0.4; K10 0.4,-0.4; K11 1.2,-0.4; K12 2,-0.4; K13 2.8,-0.4; K14 3.6,-0.4; K15 4.4,-0.4; K16 5.2,-0.4; K17 6,-0.4; K18 6.8,-0.4; L1 -6.8,-1.2; L2 -6,-1.2; L3 -5.2,-1.2; L4 -4.4,-1.2; L5 -3.6,-1.2; L6 -2.8,-1.2; L7 -2,-1.2; L8 -1.2,-1.2; L9 -0.4,-1.2; L10 0.4,-1.2; L11 1.2,-1.2; L12 2,-1.2; L13 2.8,-1.2; L14 3.6,-1.2; L15 4.4,-1.2; L16 5.2,-1.2; L17 6,-1.2; L18 6.8,-1.2; M1 -6.8,-2; M2 -6,-2; M3 -5.2,-2; M4 -4.4,-2; M5 -3.6,-2; M6 -2.8,-2; M7 -2,-2; M8 -1.2,-2; M9 -0.4,-2; M10 0.4,-2; M11 1.2,-2; M12 2,-2; M13 2.8,-2; M14 3.6,-2; M15 4.4,-2; M16 5.2,-2; M17 6,-2; M18 6.8,-2; N1 -6.8,-2.8; N2 -6,-2.8; N3 -5.2,-2.8; N4 -4.4,-2.8; N5 -3.6,-2.8; N6 -2.8,-2.8; N7 -2,-2.8; N8 -1.2,-2.8; N9 -0.4,-2.8; N10 0.4,-2.8; N11 1.2,-2.8; N12 2,-2.8; N13 2.8,-2.8; N14 3.6,-2.8; N15 4.4,-2.8; N16 5.2,-2.8; N17 6,-2.8; N18 6.8,-2.8; P1 -6.8,-3.6; P2 -6,-3.6; P3 -5.2,-3.6; P4 -4.4,-3.6; P5 -3.6,-3.6; P6 -2.8,-3.6; P7 -2,-3.6; P8 -1.2,-3.6; P9 -0.4,-3.6; P10 0.4,-3.6; P11 1.2,-3.6; P12 2,-3.6; P13 2.8,-3.6; P14 3.6,-3.6; P15 4.4,-3.6; P16 5.2,-3.6; P17 6,-3.6; P18 6.8,-3.6; R1 -6.8,-4.4; R2 -6,-4.4; R3 -5.2,-4.4; R4 -4.4,-4.4; R5 -3.6,-4.4; R6 -2.8,-4.4; R7 -2,-4.4; R8 -1.2,-4.4; R9 -0.4,-4.4; R10 0.4,-4.4; R11 1.2,-4.4; R12 2,-4.4; R13 2.8,-4.4; R14 3.6,-4.4; R15 4.4,-4.4; R16 5.2,-4.4; R17 6,-4.4; R18 6.8,-4.4; T1 -6.8,-5.2; T2 -6,-5.2; T3 -5.2,-5.2; T4 -4.4,-5.2; T5 -3.6,-5.2; T6 -2.8,-5.2; T7 -2,-5.2; T8 -1.2,-5.2; T9 -0.4,-5.2; T10 0.4,-5.2; T11 1.2,-5.2; T12 2,-5.2; T13 2.8,-5.2; T14 3.6,-5.2; T15 4.4,-5.2; T16 5.2,-5.2; T17 6,-5.2; T18 6.8,-5.2; U1 -6.8,-6; U2 -6,-6; U3 -5.2,-6; U4 -4.4,-6; U5 -3.6,-6; U6 -2.8,-6; U7 -2,-6; U8 -1.2,-6; U9 -0.4,-6; U10 0.4,-6; U11 1.2,-6; U12 2,-6; U13 2.8,-6; U14 3.6,-6; U15 4.4,-6; U16 5.2,-6; U17 6,-6; U18 6.8,-6; V1 -6.8,-6.8; V2 -6,-6.8; V3 -5.2,-6.8; V4 -4.4,-6.8; V5 -3.6,-6.8; V6 -2.8,-6.8; V7 -2,-6.8; V8 -1.2,-6.8; V9 -0.4,-6.8; V10 0.4,-6.8; V11 1.2,-6.8; V12 2,-6.8; V13 2.8,-6.8; V14 3.6,-6.8; V15 4.4,-6.8; V16 5.2,-6.8; V17 6,-6.8; V18 6.8,-6.8
DRY6 = smd 0.55 x 0.3: 1 -0.355,0.5 | smd 0.52 x 0.3: 2 -0.37,0; 3 -0.37,-0.5; 4 0.37,-0.5; 5 0.37,0; 6 0.37,0.5
DGS10 = smd 1.575 x 0.279: 1 -2.095,1; 2 -2.095,0.5; 3 -2.095,0; 4 -2.095,-0.5; 5 -2.095,-1; 6 2.095,-1; 7 2.095,-0.5; 8 2.095,0; 9 2.095,0.5; 10 2.095,1
YZH0016AFAF = smd 0.275 x 0.275: A1 -0.75,0.75; A2 -0.25,0.75; A3 0.25,0.75; A4 0.75,0.75; B1 -0.75,0.25; B2 -0.25,0.25; B3 0.25,0.25; B4 0.75,0.25; C1 -0.75,-0.25; C2 -0.25,-0.25; C3 0.25,-0.25; C4 0.75,-0.25; D1 -0.75,-0.75; D2 -0.25,-0.75; D3 0.25,-0.75; D4 0.75,-0.75
PWP20_3P4X2P4 = smd 1.27 x 0.305: 1 -2.972,2.925; 2 -2.972,2.275; 3 -2.972,1.625; 4 -2.972,0.975; 5 -2.972,0.325; 6 -2.972,-0.325; 7 -2.972,-0.975; 8 -2.972,-1.625; 9 -2.972,-2.275; 10 -2.972,-2.925; 11 2.972,-2.925; 12 2.972,-2.275; 13 2.972,-1.625; 14 2.972,-0.975; 15 2.972,-0.325; 16 2.972,0.325; 17 2.972,0.975; 18 2.972,1.625; 19 2.972,2.275; 20 2.972,2.925 | smd 2.4 x 3.4: 21 0,0
BGA144C80P9X16_1350X900X120 = smd 0.4 x 0.4: A1 -3.2,6; A2 -2.4,6; A3 -1.6,6; A7 1.6,6; A8 2.4,6; A9 3.2,6; B1 -3.2,5.2; B2 -2.4,5.2; B3 -1.6,5.2; B7 1.6,5.2; B8 2.4,5.2; B9 3.2,5.2; C1 -3.2,4.4; C2 -2.4,4.4; C3 -1.6,4.4; C7 1.6,4.4; C8 2.4,4.4; C9 3.2,4.4; D1 -3.2,3.6; D2 -2.4,3.6; D3 -1.6,3.6; D7 1.6,3.6; D8 2.4,3.6; D9 3.2,3.6; E1 -3.2,2.8; E2 -2.4,2.8; E3 -1.6,2.8; E7 1.6,2.8; E8 2.4,2.8; E9 3.2,2.8; F1 -3.2,2; F2 -2.4,2; F3 -1.6,2; F7 1.6,2; F8 2.4,2; F9 3.2,2; G1 -3.2,1.2; G2 -2.4,1.2; G3 -1.6,1.2; G7 1.6,1.2; G8 2.4,1.2; G9 3.2,1.2; H1 -3.2,0.4; H2 -2.4,0.4; H3 -1.6,0.4; H7 1.6,0.4; H8 2.4,0.4; H9 3.2,0.4; J1 -3.2,-0.4; J2 -2.4,-0.4; J3 -1.6,-0.4; J7 1.6,-0.4; J8 2.4,-0.4; J9 3.2,-0.4; K1 -3.2,-1.2; K2 -2.4,-1.2; K3 -1.6,-1.2; K7 1.6,-1.2; K8 2.4,-1.2; K9 3.2,-1.2; L1 -3.2,-2; L2 -2.4,-2; L3 -1.6,-2; L7 1.6,-2; L8 2.4,-2; L9 3.2,-2; M1 -3.2,-2.8; M2 -2.4,-2.8; M3 -1.6,-2.8; M7 1.6,-2.8; M8 2.4,-2.8; M9 3.2,-2.8; N1 -3.2,-3.6; N2 -2.4,-3.6; N3 -1.6,-3.6; N7 1.6,-3.6; N8 2.4,-3.6; N9 3.2,-3.6; P1 -3.2,-4.4; P2 -2.4,-4.4; P3 -1.6,-4.4; P7 1.6,-4.4; P8 2.4,-4.4; P9 3.2,-4.4; R1 -3.2,-5.2; R2 -2.4,-5.2; R3 -1.6,-5.2; R7 1.6,-5.2; R8 2.4,-5.2; R9 3.2,-5.2; T1 -3.2,-6; T2 -2.4,-6; T3 -1.6,-6; T7 1.6,-6; T8 2.4,-6; T9 3.2,-6
DRV0006A = smd 0.45 x 0.3: 1 -0.975,0.65; 2 -0.975,0; 3 -0.975,-0.65; 4 0.975,-0.65; 5 0.975,0; 6 0.975,0.65 | smd 1 x 1.6: 7 0,0
RTW24_2P45X2P45 = smd 0.85 x 0.28: 1 -1.975,1.25; 2 -1.975,0.75; 3 -1.975,0.25; 4 -1.975,-0.25; 5 -1.975,-0.75; 6 -1.975,-1.25; 13 1.975,-1.25; 14 1.975,-0.75; 15 1.975,-0.25; 16 1.975,0.25; 17 1.975,0.75; 18 1.975,1.25 | smd 0.28 x 0.85: 7 -1.25,-1.975; 8 -0.75,-1.975; 9 -0.25,-1.975; 10 0.25,-1.975; 11 0.75,-1.975; 12 1.25,-1.975; 19 1.25,1.975; 20 0.75,1.975; 21 0.25,1.975; 22 -0.25,1.975; 23 -0.75,1.975; 24 -1.25,1.975 | smd 2.45 x 2.45: 25 0,0 | drill 0.254 pad 0.508: V -0.787,-0.787; V_1 -0.787,0; V_2 -0.787,0.787; V_3 0,-0.787; V_4 0,0; V_5 0,0.787; V_6 0.787,-0.787; V_7 0.787,0; V_8 0.787,0.787
DCK0005A_N = smd 0.85 x 0.4: 1 -0.95,0.65; 2 -0.95,0; 3 -0.95,-0.65; 4 0.95,-0.65; 5 0.95,0.65
RHB0032B = smd 0.6 x 0.25: 1 -2.4,1.75; 2 -2.4,1.25; 3 -2.4,0.75; 4 -2.4,0.25; 5 -2.4,-0.25; 6 -2.4,-0.75; 7 -2.4,-1.25; 8 -2.4,-1.75; 17 2.4,-1.75; 18 2.4,-1.25; 19 2.4,-0.75; 20 2.4,-0.25; 21 2.4,0.25; 22 2.4,0.75; 23 2.4,1.25; 24 2.4,1.75 | smd 0.25 x 0.6: 9 -1.75,-2.4; 10 -1.25,-2.4; 11 -0.75,-2.4; 12 -0.25,-2.4; 13 0.25,-2.4; 14 0.75,-2.4; 15 1.25,-2.4; 16 1.75,-2.4; 25 1.75,2.4; 26 1.25,2.4; 27 0.75,2.4; 28 0.25,2.4; 29 -0.25,2.4; 30 -0.75,2.4; 31 -1.25,2.4; 32 -1.75,2.4 | smd 2.9 x 2.9: 33 0,0
D8 = smd 1.981 x 0.559: 1 -2.464,1.905; 2 -2.464,0.635; 3 -2.464,-0.635; 4 -2.464,-1.905; 5 2.464,-1.905; 6 2.464,-0.635; 7 2.464,0.635; 8 2.464,1.905
PAP64_5X5 = smd 1.664 x 0.279: 1 -5.62,3.75; 2 -5.62,3.25; 3 -5.62,2.75; 4 -5.62,2.25; 5 -5.62,1.75; 6 -5.62,1.25; 7 -5.62,0.75; 8 -5.62,0.25; 9 -5.62,-0.25; 10 -5.62,-0.75; 11 -5.62,-1.25; 12 -5.62,-1.75; 13 -5.62,-2.25; 14 -5.62,-2.75; 15 -5.62,-3.25; 16 -5.62,-3.75; 33 5.62,-3.75; 34 5.62,-3.25; 35 5.62,-2.75; 36 5.62,-2.25; 37 5.62,-1.75; 38 5.62,-1.25; 39 5.62,-0.75; 40 5.62,-0.25; 41 5.62,0.25; 42 5.62,0.75; 43 5.62,1.25; 44 5.62,1.75; 45 5.62,2.25; 46 5.62,2.75; 47 5.62,3.25; 48 5.62,3.75 | smd 0.279 x 1.664: 17 -3.75,-5.62; 18 -3.25,-5.62; 19 -2.75,-5.62; 20 -2.25,-5.62; 21 -1.75,-5.62; 22 -1.25,-5.62; 23 -0.75,-5.62; 24 -0.25,-5.62; 25 0.25,-5.62; 26 0.75,-5.62; 27 1.25,-5.62; 28 1.75,-5.62; 29 2.25,-5.62; 30 2.75,-5.62; 31 3.25,-5.62; 32 3.75,-5.62; 49 3.75,5.62; 50 3.25,5.62; 51 2.75,5.62; 52 2.25,5.62; 53 1.75,5.62; 54 1.25,5.62; 55 0.75,5.62; 56 0.25,5.62; 57 -0.25,5.62; 58 -0.75,5.62; 59 -1.25,5.62; 60 -1.75,5.62; 61 -2.25,5.62; 62 -2.75,5.62; 63 -3.25,5.62; 64 -3.75,5.62 | smd 5 x 5: EPAD 0,0 | drill 0.508 pad 0.508: V -1.981,-1.981; V_1 -1.981,-1.168; V_2 -1.981,-0.406; V_3 -1.981,0.406; V_4 -1.981,1.168; V_5 -1.981,1.981; V_6 -1.168,-1.981; V_7 -1.168,-1.168; V_8 -1.168,-0.406; V_9 -1.168,0.406; V_10 -1.168,1.168; V_11 -1.168,1.981; V_12 -0.406,-1.981; V_13 -0.406,-1.168; V_14 -0.406,-0.406; V_15 -0.406,0.406; V_16 -0.406,1.168; V_17 -0.406,1.981; V_18 0.406,-1.981; V_19 0.406,-1.168; V_20 0.406,-0.406; V_21 0.406,0.406; V_22 0.406,1.168; V_23 0.406,1.981; V_24 1.168,-1.981; V_25 1.168,-1.168; V_26 1.168,-0.406; V_27 1.168,0.406; V_28 1.168,1.168; V_29 1.168,1.981; V_30 1.981,-1.981; V_31 1.981,-1.168; V_32 1.981,-0.406; V_33 1.981,0.406; V_34 1.981,1.168; V_35 1.981,1.981
D0008A_N = smd 1.6 x 0.6: 1 -2.4,1.905; 2 -2.4,0.635; 3 -2.4,-0.635; 4 -2.4,-1.905; 5 2.4,-1.905; 6 2.4,-0.635; 7 2.4,0.635; 8 2.4,1.905
RWG0040A = smd 0.6 x 0.25: 1 -2.9,2.25; 2 -2.9,1.75; 3 -2.9,1.25; 4 -2.9,0.75; 5 -2.9,0.25; 6 -2.9,-0.25; 7 -2.9,-0.75; 8 -2.9,-1.25; 9 -2.9,-1.75; 10 -2.9,-2.25; 21 2.9,-2.25; 22 2.9,-1.75; 23 2.9,-1.25; 24 2.9,-0.75; 25 2.9,-0.25; 26 2.9,0.25; 27 2.9,0.75; 28 2.9,1.25; 29 2.9,1.75; 30 2.9,2.25 | smd 0.25 x 0.6: 11 -2.25,-2.9; 12 -1.75,-2.9; 13 -1.25,-2.9; 14 -0.75,-2.9; 15 -0.25,-2.9; 16 0.25,-2.9; 17 0.75,-2.9; 18 1.25,-2.9; 19 1.75,-2.9; 20 2.25,-2.9; 31 2.25,2.9; 32 1.75,2.9; 33 1.25,2.9; 34 0.75,2.9; 35 0.25,2.9; 36 -0.25,2.9; 37 -0.75,2.9; 38 -1.25,2.9; 39 -1.75,2.9; 40 -2.25,2.9 | smd 3.3 x 3.3: 41 0,0
RLT0007A = smd 0.6 x 0.25: 1 -0.9,0.75; 2 -0.9,0.25; 3 -0.9,-0.25; 4 -0.9,-0.75 | smd 1.64 x 0.44: 5 0.45,-0.6; 6 0.45,0; 7 0.45,0.6
DRC0010J = smd 0.6 x 0.24: 1 -1.4,1; 2 -1.4,0.5; 3 -1.4,0; 4 -1.4,-0.5; 5 -1.4,-1; 6 1.4,-1; 7 1.4,-0.5; 8 1.4,0; 9 1.4,0.5; 10 1.4,1 | smd 1.65 x 2.4: 11 0,0
DDC0006A_N = smd 1 x 0.6: 1 -1.375,0.95; 2 -1.375,0; 3 -1.375,-0.95; 4 1.375,-0.95; 5 1.375,0; 6 1.375,0.95
DCK6 = smd 1.168 x 0.356: 1 -0.978,0.65; 2 -0.978,0; 3 -0.978,-0.65; 4 0.978,-0.65; 5 0.978,0; 6 0.978,0.65
XFL4015-471MEB = smd 3.4 x 0.98: P$1 0,0; P$2 0,2.37
SOIC127P600X175-8_V2 = smd 1.968 x 0.602: 1 -2.473,1.905; 2 -2.473,0.635; 3 -2.473,-0.635; 4 -2.473,-1.905; 5 2.473,-1.905; 6 2.473,-0.635; 7 2.473,0.635; 8 2.473,1.905
XFL4020-102MEB = smd 3.4 x 0.98: V 0,0; V1 0,2.37
OSCCC120X100X35 = smd 0.52 x 0.47: 1 -0.41,-0.335; 2 0.41,-0.335; 3 0.41,0.335; 4 -0.41,0.335
OSCCC320X250X70 = smd 1.321 x 1.22: 1 -1.196,-0.896; 2 1.196,-0.896; 3 1.196,0.896; 4 -1.196,0.896
OSCCC250X200X65 = smd 1.112 x 1.012: 1 -0.95,-0.75; 2 0.95,-0.75; 3 0.95,0.75; 4 -0.95,0.75
SOT23-6 = smd 0.635 x 1.27: P$1 -0.953,-1.27; P$2 0,-1.27; P$3 0.953,-1.27; P$4 0.953,1.27; P$5 0,1.27; P$6 -0.953,1.27
BGA153C50P14X14_1150X1300X100N = smd 0.26 x 0.26: A1 -3.25,3.25; A2 -2.75,3.25; A3 -2.25,3.25; A4 -1.75,3.25; A5 -1.25,3.25; A6 -0.75,3.25; A7 -0.25,3.25; A8 0.25,3.25; A9 0.75,3.25; A10 1.25,3.25; A11 1.75,3.25; A12 2.25,3.25; A13 2.75,3.25; A14 3.25,3.25; B1 -3.25,2.75; B2 -2.75,2.75; B3 -2.25,2.75; B4 -1.75,2.75; B5 -1.25,2.75; B6 -0.75,2.75; B7 -0.25,2.75; B8 0.25,2.75; B9 0.75,2.75; B10 1.25,2.75; B11 1.75,2.75; B12 2.25,2.75; B13 2.75,2.75; B14 3.25,2.75; C1 -3.25,2.25; C2 -2.75,2.25; C3 -2.25,2.25; C4 -1.75,2.25; C5 -1.25,2.25; C6 -0.75,2.25; C7 -0.25,2.25; C8 0.25,2.25; C9 0.75,2.25; C10 1.25,2.25; C11 1.75,2.25; C12 2.25,2.25; C13 2.75,2.25; C14 3.25,2.25; D1 -3.25,1.75; D2 -2.75,1.75; D3 -2.25,1.75; D4 -1.75,1.75; D12 2.25,1.75; D13 2.75,1.75; D14 3.25,1.75; E1 -3.25,1.25; E2 -2.75,1.25; E3 -2.25,1.25; E5 -1.25,1.25; E6 -0.75,1.25; E7 -0.25,1.25; E8 0.25,1.25; E9 0.75,1.25; E10 1.25,1.25; E12 2.25,1.25; E13 2.75,1.25; E14 3.25,1.25; F1 -3.25,0.75; F2 -2.75,0.75; F3 -2.25,0.75; F5 -1.25,0.75; F10 1.25,0.75; F12 2.25,0.75; F13 2.75,0.75; F14 3.25,0.75; G1 -3.25,0.25; G2 -2.75,0.25; G3 -2.25,0.25; G5 -1.25,0.25; G10 1.25,0.25; G12 2.25,0.25; G13 2.75,0.25; G14 3.25,0.25; H1 -3.25,-0.25; H2 -2.75,-0.25; H3 -2.25,-0.25; H5 -1.25,-0.25; H10 1.25,-0.25; H12 2.25,-0.25; H13 2.75,-0.25; H14 3.25,-0.25; J1 -3.25,-0.75; J2 -2.75,-0.75; J3 -2.25,-0.75; J5 -1.25,-0.75; J10 1.25,-0.75; J12 2.25,-0.75; J13 2.75,-0.75; J14 3.25,-0.75; K1 -3.25,-1.25; K2 -2.75,-1.25; K3 -2.25,-1.25; K5 -1.25,-1.25; K6 -0.75,-1.25; K7 -0.25,-1.25; K8 0.25,-1.25; K9 0.75,-1.25; K10 1.25,-1.25; K12 2.25,-1.25; K13 2.75,-1.25; K14 3.25,-1.25; L1 -3.25,-1.75; L2 -2.75,-1.75; L3 -2.25,-1.75; L12 2.25,-1.75; L13 2.75,-1.75; L14 3.25,-1.75; M1 -3.25,-2.25; M2 -2.75,-2.25; M3 -2.25,-2.25; M4 -1.75,-2.25; M5 -1.25,-2.25; M6 -0.75,-2.25; M7 -0.25,-2.25; M8 0.25,-2.25; M9 0.75,-2.25; M10 1.25,-2.25; M11 1.75,-2.25; M12 2.25,-2.25; M13 2.75,-2.25; M14 3.25,-2.25; N1 -3.25,-2.75; N2 -2.75,-2.75; N3 -2.25,-2.75; N4 -1.75,-2.75; N5 -1.25,-2.75; N6 -0.75,-2.75; N7 -0.25,-2.75; N8 0.25,-2.75; N9 0.75,-2.75; N10 1.25,-2.75; N11 1.75,-2.75; N12 2.25,-2.75; N13 2.75,-2.75; N14 3.25,-2.75; P1 -3.25,-3.25; P2 -2.75,-3.25; P3 -2.25,-3.25; P4 -1.75,-3.25; P5 -1.25,-3.25; P6 -0.75,-3.25; P7 -0.25,-3.25; P8 0.25,-3.25; P9 0.75,-3.25; P10 1.25,-3.25; P11 1.75,-3.25; P12 2.25,-3.25; P13 2.75,-3.25; P14 3.25,-3.25
HVQFN28 = smd 1.1 x 0.3: 1 -2.95,1.95; 2 -2.95,1.3; 3 -2.95,0.65; 4 -2.95,0; 5 -2.95,-0.65; 6 -2.95,-1.3; 7 -2.95,-1.95; 15 2.95,-1.95; 16 2.95,-1.3; 17 2.95,-0.65; 18 2.95,0; 19 2.95,0.65; 20 2.95,1.3; 21 2.95,1.95 | smd 0.3 x 1.1: 8 -1.95,-2.95; 9 -1.3,-2.95; 10 -0.65,-2.95; 11 0,-2.95; 12 0.65,-2.95; 13 1.3,-2.95; 14 1.95,-2.95; 22 1.95,2.95; 23 1.3,2.95; 24 0.65,2.95; 25 0,2.95; 26 -0.65,2.95; 27 -1.3,2.95; 28 -1.95,2.95 | smd 4.1 x 4.1: PAD 0,0
DB2441700L = smd 2.1 x 1.4: ANODE 0,0; CATHODE 0,4.4
XEL6030-152MEB = smd 5.5 x 1.43: P$1 0,0; P$2 0,4.04
XEL4030-682ME_ = smd 3.4 x 0.98: P$1 0,0; P$2 0,2.37
J1 = drill 0.9 pad 1.3: 1 4.445,2.54; 2 3.175,0; 3 1.905,2.54; 4 0.635,0; 5 -0.635,2.54; 6 -1.905,0; 7 -3.175,2.54; 8 -4.445,0 | drill 1 pad 1.422: 9 5.465,7.37; 10 2.925,7.37; 11 -2.925,7.37; 12 -5.465,7.37 | drill 1.6 pad 2.184: M1 -7.875,-3.3; M2 7.875,-3.3 | hole 3.3: 5.715,-6.35; -5.715,-6.35
USB-A-H = drill 0.914: D+ 2.718,-1.003; D- 2.718,1.003; GND 2.718,-3.493; VBUS 2.718,3.493 | drill 2.311: P$5 0,-6.566; P$6 0,6.566

## Placement (x,y rotation side)
C1  0.1uF  [0603]  50.29,63.5 0 top
C2  0.1uF  [0603]  49.66,60.07 90 top
C3  0.1uF  [0603]  50.29,57.79 0 top
C4  10uF  [0603]  41.78,24.13 0 top
C5  0.1uF  [0603]  41.78,22.48 0 top
C6  22uF  [0603]  52.58,24.26 180 top
C7  0.1uF  [0603]  52.58,22.61 180 top
C8  0.1uF  [0603]  41.91,18.03 270 top
C9  0.1uF  [0603]  56.39,56.64 0 top
C10  0.1uF  [0603]  55.75,53.21 90 top
C11  0.1uF  [0603]  56.39,50.93 0 top
C12  0.1uF  [0603]  6.73,53.34 270 bottom
C13  0.1uF  [0603]  6.35,79.25 180 top
C14  10uF  [0402]  34.42,68.58 0 bottom
C15  0.01uF  [0201]  32.77,67.01 90 bottom
C16  0.01uF  [0201]  37.13,69.77 180 bottom
C17  0.01uF  [0201]  37.54,67.01 90 bottom
C18  0.01uF  [0201]  32.79,70.15 90 bottom
C19  0.01uF  [0201]  33.99,70.59 0 bottom
C20  0.01uF  [0201]  37.13,65.79 180 bottom
C21  0.01uF  [0201]  37.13,71.35 0 bottom
C22  0.01uF  [0201]  33.58,66.19 270 bottom
C23  10uF  [0402]  37.72,68.58 180 bottom
C24  0.01uF  [0201]  31.37,76.45 90 bottom
C25  0.01uF  [0201]  38.73,72.14 180 bottom
C26  0.01uF  [0201]  37.13,72.14 0 bottom
C27  0.01uF  [0201]  38.73,71.35 180 bottom
C28  0.01uF  [0201]  37.95,70.54 180 bottom
C29  0.1uF  [0603]  4.06,76.07 90 bottom
C30  0.1uF  [0603]  3.56,71.75 270 top
C31  0.1uF  [0603]  10.03,67.56 90 top
C32  0.1uF  [0603]  7.24,68.33 0 top
C33  0.1uF  [0603]  6.48,74.04 0 top
C34  150uF  [CAPPRD350W65D800H1500B]  4.45,57.15 180 top
C35  150uF  [CAPPRD350W65D800H1500B]  18.41,57.15 0 top
C36  10uF  [0603]  18.16,51.44 180 bottom
C37  10uF  [0603]  18.16,47.62 180 bottom
C38  10uF  [0603]  16.89,54.36 0 bottom
C39  1nF  [0603]  4.45,51.69 180 bottom
C40  1nF  [0603]  2.67,53.34 180 bottom
C41  4.7uF  [0603]  2.16,50.04 270 bottom
C42  10uF  [0603]  19.68,54.86 270 bottom
C43  10uF  [0603]  21.21,54.86 270 bottom
C44  0.033uF  [0603]  16.64,49.91 0 bottom
C45  4.7uF  [0603]  17.02,41.27 270 top
C46  0.1uF  [0603]  18.67,43.81 0 bottom
C47  0.1uF  [0603]  2.16,47.88 180 bottom
C48  0.1uF  [0402]  23.37,76.2 270 top
C49  0.1uF  [0402]  11.81,73.28 0 top
C50  0.1uF  [0402]  16.38,62.1 0 top
C51  0.1uF  [0402]  17.91,77.6 0 top
C52  0.1uF  [0402]  12.06,70.23 90 top
C53  0.1uF  [0402]  12.06,67.31 90 top
C54  0.1uF  [0402]  18.67,62.1 0 top
C55  0.1uF  [0402]  21.34,77.6 0 top
C56  1uF  [0402]  14.22,77.6 0 top
C57  1uF  [0402]  14.1,62.1 0 top
C58  0.1uF  [0201]  31.57,69.75 0 bottom
C59  0.1uF  [0402]  14.61,72.26 180 bottom
C60  2.2uF  [0603]  12.7,59.44 0 top
C61  0.1uF  [0201]  18.03,69.09 90 bottom
C62  10uF  [0603]  12.06,75.44 90 top
C63  10uF  [0603]  12.06,64.26 90 top
C64  10uF  [0402]  14.61,78.87 270 bottom
C65  10uF  [0402]  17.91,78.87 270 bottom
C66  10uF  [0402]  23.88,60.96 0 bottom
C67  10uF  [0402]  32.26,68.58 0 bottom
C68  10uF  [0402]  35.56,71.5 90 bottom
C69  0.01uF  [0201]  32.38,65.79 0 bottom
C70  0.01uF  [0201]  34.39,65.41 270 bottom
C71  0.01uF  [0201]  36.73,74.98 270 bottom
C72  0.01uF  [0201]  33.99,72.16 0 bottom
C73  0.01uF  [0201]  33.17,73.76 180 bottom
C74  0.01uF  [0201]  33.17,72.95 0 bottom
C75  0.01uF  [0201]  32.79,71.75 90 bottom
C76  0.01uF  [0201]  41.94,70.54 0 bottom
C77  10uF  [0402]  35.56,64.77 270 bottom
C78  0.01uF  [0201]  42.04,65.91 0 bottom
C79  0.01uF  [0201]  35.94,62.99 90 bottom
C80  10uF  [0402]  35.56,76.07 270 bottom
C81  0.01uF  [0201]  34.77,72.95 180 bottom
C82  0.01uF  [0201]  41.15,64.19 0 bottom
C83  0.01uF  [0201]  41.15,65 0 bottom
C84  0.01uF  [0201]  40.34,65.84 180 bottom
C85  0.01uF  [0201]  39.93,64.62 270 bottom
C86  1uF  [0603]  46.35,36.07 90 bottom
C87  0.1uF  [0603]  50.29,33.53 270 bottom
C88  1uF  [0201]  35.59,74.57 180 bottom
C89  1uF  [0201]  32,73.36 90 bottom
C90  1uF  [0201]  36.73,73.36 90 bottom
C91  1uF  [0201]  34.77,73.76 0 bottom
C92  0.01uF  [0201]  37.54,64.62 270 bottom
C93  10uF  [0402]  35.56,66.93 270 bottom
C94  10uF  [0402]  35.94,78.23 270 bottom
C95  10uF  [0402]  44.2,74.68 0 bottom
C96  10uF  [0402]  37.08,59.69 270 top
C97  10uF  [0402]  38.35,76.71 0 bottom
C98  10uF  [0402]  43.69,68.45 270 bottom
C99  0.01uF  [0201]  38.35,73.36 270 bottom
C100  0.01uF  [0201]  39.14,73.36 270 bottom
C101  0.01uF  [0201]  38.73,69.75 180 bottom
C102  0.01uF  [0201]  38.35,64.62 270 bottom
C103  0.01uF  [0201]  33.58,64.62 270 bottom
C104  0.01uF  [0201]  32.38,65 0 bottom
C105  0.01uF  [0201]  35.94,73.38 270 bottom
C106  0.01uF  [0201]  40.34,72.16 0 bottom
C107  0.01uF  [0201]  34.39,63.8 90 bottom
C108  0.01uF  [0201]  40.34,63.4 0 bottom
C109  0.01uF  [0201]  35.94,68.71 90 bottom
C110  0.01uF  [0201]  40.34,72.95 0 bottom
C111  0.01uF  [0201]  37.54,73.36 270 bottom
C112  0.01uF  [0201]  39.14,65.41 270 bottom
C113  0.01uF  [0201]  33.6,62.99 90 bottom
C114  0.01uF  [0201]  36.73,64.62 270 bottom
C115  4.7uF  [0402]  34.16,75.31 270 bottom
C116  0.01uF  [0201]  33.15,75.18 270 bottom
C117  0.1uF  [0402]  30.73,27.69 0 bottom
C118  0.1uF  [0402]  31.75,78.99 0 bottom
C119  7.36pF  [0402]  42.67,60.07 270 bottom
C120  7.36pF  [0402]  47.62,62.48 270 bottom
C121  12.5pF  [0402]  29.21,78.87 0 bottom
C122  12.5pF  [0402]  26.42,79.76 90 bottom
C123  0.01uF  [0402]  52.45,83.57 180 bottom
C124  0.01uF  [0402]  55.63,82.55 270 bottom
C125  0.1uF  [0402]  52.45,82.42 180 bottom
C126  0.1uF  [0402]  57.53,82.17 270 bottom
C127  1uF  [0402]  52.45,81.28 180 bottom
C128  1uF  [0402]  58.8,82.17 270 bottom
C129  10uF  [0402]  52.7,78.87 0 bottom
C130  10uF  [0402]  56.39,77.72 180 bottom
C131  0.1uF  [0402]  67.94,78.61 0 bottom
C132  1uF  [0402]  67.94,80.01 0 bottom
C133  1uF  [0402]  64.01,81.91 0 bottom
C134  0.1uF  [0402]  65.28,83.18 0 bottom
C135  0.1uF  [0402]  62.23,83.82 270 bottom
C136  1uF  [0402]  60.96,83.82 90 bottom
C137  0.1uF  [0402]  62.23,76.2 270 bottom
C138  1uF  [0402]  60.83,76.2 90 bottom
C139  0.1uF  [0402]  7.24,83.06 0 top
C140  1uF  [0402]  7.24,84.33 0 top
C141  1000pF  [0402]  3.56,90.04 180 top
C142  470uF  [CAPPRD300W65D800H1200B]  30.23,29.46 180 top
C143  270uF  [CAPPRD350W65D800H1500B]  38.73,29.46 180 top
C144  270uF  [CAPPRD350W65D800H1500B]  34.54,19.3 90 top
C145  470uF  [CAPPRD300W65D800H1200B]  26.04,19.3 90 top
C146  220uF  [CAPPRD250W65D600H1100B]  4.45,33.02 90 top
C147  470uF  [CAPPRD300W65D800H1200B]  4.45,25.4 90 top
C148  4.7uF  [0603]  4.57,44.96 270 top
C149  4.7uF  [0603]  3.05,44.96 270 top
C150  0.47uF  [0603]  7.75,45.34 180 top
C151  1uF  [0603]  7.11,46.1 270 bottom
C152  0.1uF  [0603]  5.59,36.32 0 bottom
C153  0.1uF  [0603]  13.34,37.08 270 bottom
C154  100pF  [0603]  2.16,43.81 180 bottom
C155  0.01uF  [0603]  2.16,45.34 180 bottom
C156  0.056uF  [0603]  4.95,46.74 180 bottom
C157  47uF  [0805]  38.61,34.92 0 top
C158  4.7uF  [0603]  65.41,38.61 180 top
C159  100uF  [0805]  2.67,25.53 270 bottom
C160  0.1uF  [0603]  64.26,47.88 0 top
C161  47uF  [0805]  1.78,33.27 270 bottom
C162  10uF  [0603]  7.75,25.4 0 bottom
C163  1uF  [0603]  7.75,27.05 0 bottom
C164  0.1uF  [0603]  7.75,28.7 0 bottom
C165  0.01uF  [0603]  1.91,36.96 90 bottom
C166  2.2uF  [0603]  11.56,45.97 90 bottom
C167  0.47uF  [0603]  7.24,30.23 180 bottom
C168  2.2uF  [0603]  7.11,32.77 180 bottom
C169  33pF  [0603]  2.16,40.64 180 bottom
C170  33pF  [0603]  18.54,23.5 90 bottom
C171  0.056uF  [0603]  13.08,44.32 270 bottom
C172  100pF  [0603]  15.37,43.81 180 bottom
C173  0.01uF  [0603]  16.64,42.29 180 bottom
C174  47uF  [0805]  39.75,18.92 270 top
C175  10uF  [0603]  38.86,30.86 180 bottom
C176  22uF  [0603]  46.48,26.16 90 bottom
C177  10uF  [0603]  64.26,49.53 180 top
C178  4.7uF  [0603]  65.66,56.52 180 top
C179  0.1uF  [0603]  64.26,65.66 0 top
C180  10uF  [0603]  64.26,67.31 180 top
C181  10uF  [0603]  45.85,27.69 0 top
C182  0.1uF  [0603]  45.85,26.04 0 top
C183  22uF  [0603]  50.29,34.04 0 top
C184  0.1uF  [0603]  50.29,32.38 0 top
C185  0.1uF  [0603]  45.72,22.86 180 top
C186  0.1uF  [0402]  63.37,16.64 180 bottom
C187  0.1uF  [0402]  62.87,21.84 270 bottom
C188  0.1uF  [0402]  59.56,19.56 90 bottom
C189  0.1uF  [0402]  59.44,22.86 270 bottom
C190  0.1uF  [0402]  61.72,26.67 0 bottom
C191  1uF  [0603]  46.99,32.64 90 bottom
C192  0.1uF  [0603]  50.29,30.1 270 bottom
C193  10uF  [0805]  4.19,12.83 180 bottom
C194  0.1uF  [0805]  4.19,15.11 180 bottom
C195  0.1uF  [0603]  12.06,20.45 90 top
C196  0.015uF  [0603]  13.34,15.11 180 bottom
C197  150pF  [0603]  14.73,16.76 180 bottom
C198  22uF  [0603]  14.73,31.12 180 bottom
C199  22uF  [0603]  14.73,29.34 180 bottom
C200  200pF  [0603]  15.62,21.34 180 bottom
C201  0.1uF  [0402]  61.72,25.27 0 bottom
C202  1uF  [0402]  58.29,22.86 270 bottom
C203  1uF  [0402]  63.37,17.78 180 bottom
C204  1uF  [0402]  67.18,17.65 0 bottom
C205  1uF  [0402]  70.23,17.65 0 bottom
C206  1uF  [0402]  73.28,18.67 270 bottom
C207  1uF  [0402]  58.8,26.54 180 bottom
C208  1uF  [0402]  70.1,27.56 0 bottom
C209  10uF  [0603]  66.42,19.3 0 bottom
C210  10uF  [0603]  65.66,26.04 0 bottom
C211  10uF  [0603]  70.48,21.72 270 bottom
C212  1000pF  [0402]  70.23,6.22 270 bottom
C213  1uF  [0402]  26.67,89.15 270 top
C214  1uF  [0402]  27.94,89.15 270 top
C215  1uF  [0402]  29.21,89.15 270 top
C216  DNI  [0603]  7.87,18.92 270 top
C217  1uF  [0402]  30.48,89.15 270 top
C218  1uF  [0402]  34.29,89.15 270 top
C219  1uF  [0402]  33.02,89.15 270 top
C220  1uF  [0402]  36.83,89.15 270 top
C221  1uF  [0402]  35.56,89.15 270 top
C222  0.1uF  [0402]  37.47,80.77 0 top
C223  0.1uF  [0402]  43.94,87.5 180 top
C224  1uF  [0402]  43.94,88.77 180 top
C225  1uF  [0402]  40.89,80.01 270 top
C226  4.7uF  [0603]  25.4,43.56 180 bottom
C227  4.7uF  [0603]  31.24,47.75 90 bottom
C228  4.7uF  [0603]  40.64,49.66 0 bottom
C229  0.1uF  [0603]  43.43,49.91 180 bottom
C230  4.7uF  [0603]  46.35,47.75 270 bottom
C231  4.7uF  [0603]  40.77,43.56 0 bottom
C232  1uF  [0402]  43.69,83.31 0 bottom
C233  0.1uF  [0402]  41.55,85.75 270 bottom
C234  0.22uF  [0603]  28.19,43.56 180 bottom
C235  0.22uF  [0603]  26.92,48.51 90 bottom
C236  0.22uF  [0603]  43.56,43.56 180 bottom
C237  0.22uF  [0603]  43.94,48.13 0 bottom
C238  18pF  [0402]  53.85,90.93 270 top
C239  18pF  [0402]  50.39,88.09 270 top
C464  4.7uF  [0603]  24.13,52.2 0 bottom
C465  0.1uF  [0603]  24.13,50.55 0 bottom
C574  0.1uF  [0402]  5.97,14.86 0 top
C575  0.01uF  [0402]  12.06,16.89 0 top
C577  DNI  [0402]  47.24,15.62 0 top
C578  0.1uF  [0402]  44.7,16.26 180 bottom
C579  0.1uF  [0402]  51.44,14.35 90 top
D1  Green  [0603.LED]  56.39,21.21 180 top
D2  White  [0603.LED]  21.08,6.98 90 top
D5  Green  [0603.LED]  30.86,14.1 180 top
D6  Green  [0603.LED]  37.97,23.88 90 top
HDMI  HDMI-A  [HDMI_A]  71.12,5.08 0 top
J1  SEAM-40-XX.X-XX-06-X-A  [SEAM-40-XX.X-XX-06-X-A]  30.48,7.62 0 bottom
JP1  [2X10]  20.32,93.98 180 top
JP2  [1X09]  64.77,95.25 0 top
JP3  [2X05]  33.02,85.09 0 top
Q8  CSD18543Q3A  [SON65P300X315X90-9N]  10.03,31.75 180 top
Q9  CSD18543Q3A  [SON65P300X315X90-9N]  23.24,31.75 180 top
Q10  CSD18543Q3A  [SON65P300X315X90-9N]  24,25.91 90 top
Q11  CSD18543Q3A  [SON65P300X315X90-9N]  11.05,25.4 180 top
R1  10_1%  [0603]  48.01,58.67 270 top
R2  10_1%  [0603]  48.01,61.47 90 top
R3  0.002_1%  [1206]  45.85,60.07 90 top
R4  10_1%  [0603]  54.1,51.82 270 top
R5  10_1%  [0603]  54.1,54.61 90 top
R6  0.002_1%  [1206]  51.94,53.21 90 top
R7  10_1%  [0603]  4.06,74.55 270 top
R8  10_1%  [0603]  4.06,77.6 90 top
R9  0.002_1%  [1206]  2.03,76.07 90 top
R10  10_1%  [0603]  5.84,69.98 180 top
R11  10_1%  [0603]  8.64,69.98 0 top
R12  0.002_1%  [1206]  7.24,72.01 0 top
R13  5.11R  [0603]  10.41,55.12 180 bottom
R14  7.15k  [0603]  4.83,50.04 0 bottom
R15  100k  [0603]  5.33,48.39 0 bottom
R16  0.006R  [0805]  1.91,49.78 90 top
R17  3.09R  [0603]  5.08,54.99 90 bottom
R18  DNI  [0603]  2.67,54.99 0 bottom
R19  4.75k  [0603]  16.64,46.1 0 top
R20  4.75k  [0603]  13.59,46.1 0 top
R21  240R_1%  [0402]  11.81,71.88 0 top
R22  120R  [0402]  26.04,11.05 180 top
R25  22R_1%  [0201]  18.03,70.48 90 bottom
R26  22R_1%  [0201]  17.14,70.48 90 bottom
R27  22R_1%  [0201]  14.1,70.61 180 bottom
R28  22R_1%  [0201]  22.48,73.02 270 bottom
R29  22R_1%  [0201]  23.24,71.37 90 bottom
R30  22R_1%  [0201]  24.64,70.87 90 bottom
R31  22R_1%  [0201]  18.92,70.48 90 bottom
R32  22R_1%  [0201]  18.41,72.01 270 bottom
R33  22R_1%  [0201]  23.5,72.77 90 bottom
R34  22R_1%  [0201]  18.29,74.93 180 bottom
R35  22R_1%  [0201]  24.38,73.15 90 bottom
R36  22R_1%  [0201]  25.27,74.04 90 bottom
R37  22R_1%  [0201]  17.65,74.04 0 bottom
R38  22R_1%  [0201]  18.8,73.79 90 bottom
R39  22R_1%  [0201]  22.73,74.55 0 bottom
R40  22R_1%  [0201]  13.46,75.56 180 bottom
R41  22R_1%  [0201]  21.72,77.47 270 bottom
R42  22R_1%  [0201]  14.86,77.09 270 bottom
R43  22R_1%  [0201]  20.83,77.47 270 bottom
R44  22R_1%  [0201]  14.22,77.09 270 bottom
R45  22R_1%  [0201]  17.53,72.01 270 bottom
R46  22R_1%  [0201]  18.03,75.95 270 bottom
R47  22R_1%  [0201]  17.14,76.07 270 bottom
R48  22R_1%  [0201]  17.65,73.15 0 bottom
R49  22R_1%  [0201]  19.56,77.6 270 bottom
R50  22R_1%  [0201]  16.13,77.22 270 bottom
R51  49.9R_1%  [0201]  29.97,69.75 0 bottom
R52  10k  [0603]  48.64,33.53 270 bottom
R53  33R_1%  [0402]  50.9,77.11 0 top
R54  4.7k  [0603]  46.99,29.08 90 bottom
R55  10k  [0402]  34.42,26.16 90 top
R56  4.7k  [0603]  34.8,94.61 0 top
R57  4.7k  [0603]  34.8,92.71 0 top
R58  4.7k  [0603]  34.8,96.27 180 top
R59  DNI  [0402]  20.32,93.98 180 bottom
R60  2.2k  [0402]  56.64,84.2 180 bottom
R61  4.87k_1%  [0402]  56.29,85.45 90 top
R62  1k  [0402]  50.6,85.8 90 top
R63  DNI  [0402]  56.24,87.68 0 top
R64  49.9R  [0402]  61.59,85.72 0 bottom
R65  49.9R  [0402]  64.14,84.45 0 bottom
R66  49.9R  [0402]  64.14,76.83 0 bottom
R67  49.9R  [0402]  61.59,78.11 0 bottom
R68  0R  [0402]  51.92,85.39 90 top
R69  DNI  [0402]  54.31,85.65 0 top
R70  DNI  [0402]  56.13,75.9 180 top
R71  1M  [0402]  3.56,91.31 0 top
R72  1k  [0402]  40.51,14.48 270 top
R73  10k  [0402]  61.59,47.62 0 top
R74  10k  [0402]  60.58,41.27 270 top
R75  10k  [0402]  61.59,65.41 0 top
R76  10k  [0402]  60.58,59.05 270 top
R77  4.7k  [0402]  55.75,61.21 0 bottom
R78  4.7k  [0402]  55.75,62.48 0 bottom
R79  510R  [0402]  64.14,12.83 90 top
R80  1k  [0402]  61.47,15.24 90 top
R81  330R  [0402]  59.05,21.21 0 top
R82  1M  [0402]  71.5,6.22 90 bottom
R83  4.7k  [0402]  55.24,11.43 90 top
R84  4.7k  [0402]  53.98,11.43 90 top
R85  10k  [0402]  45.09,75.31 270 top
R86  DNI  [0402]  43.94,75.31 90 top
R87  330R  [0603]  19.56,6.98 90 top
R88  10k  [0402]  12.7,7.49 270 top
R89  DNI  [0402]  11.43,7.49 90 top
R90  10k  [0402]  67.82,54.61 0 bottom
R91  10k  [0402]  67.82,53.34 0 bottom
R94  10k  [0402]  37.47,8.89 90 top
R95  10k  [0402]  36.2,8.89 90 top
R96  10k  [0402]  29.72,19.81 0 bottom
R97  10k  [0402]  27.56,19.81 180 bottom
R98  10k  [0402]  46.94,83.31 180 bottom
R99  33R_1%  [0402]  49.17,78.31 0 top
R100  33R_1%  [0402]  49.17,79.53 0 top
R101  33R_1%  [0402]  49.17,80.75 0 top
R102  33R_1%  [0402]  49.17,83.31 0 top
R202  10.2R  [0603]  4.45,38.35 270 bottom
R203  10.2R  [0603]  8.38,36.32 0 bottom
R204  10.2R  [0603]  7.75,34.8 0 bottom
R205  0.005R  [R2512]  25.02,35.81 180 top
R206  0R  [0603]  2.16,39.12 0 bottom
R207  19.6k 0.1%  [0603]  4.32,44.45 270 bottom
R208  100k  [0603]  3.94,42.04 90 top
R211  10.2R  [0603]  14.86,38.73 270 bottom
R212  10.2R  [0603]  11.18,36.32 180 bottom
R213  10.2R  [0603]  11.18,34.8 180 bottom
R214  49.9R  [0603]  2.16,42.16 0 bottom
R215  49.9R  [0603]  19.3,25.65 180 bottom
R216  49.9R  [0603]  19.3,21.34 180 bottom
R217  0.005R  [R2512]  17.65,18.03 0 top
R218  29.4k 1%  [0603]  13.72,42.16 180 bottom
R219  220R  [0603]  39.5,23.88 270 top
R220  330R  [0603]  33.78,14.1 180 top
R229  10k  [0603]  48.64,30.1 270 bottom
R230  100k  [0603]  9.53,18.92 90 top
R231  2.05k_1%  [0603]  11.94,16.76 0 bottom
R232  51.1R_1%  [0603]  17.65,16.76 180 bottom
R233  31.6k_1%  [0603]  16.51,19.05 270 bottom
R234  10k_1%  [0603]  14.99,19.05 90 bottom
R243  100k  [0603]  9.4,45.85 180 bottom
R536  261k_1%  [0402]  13.21,14.35 0 top
R537  10k_1%  [0402]  13.21,15.49 180 top
R538  10k_1%  [0402]  14.99,13.72 90 top
R540  5.81k_1%  [0402]  42.8,14.35 180 top
R541  10k_1%  [0402]  45.21,13.46 180 top
R542  10k_1%  [0402]  45.97,15.11 0 bottom
R543  0R  [0402]  52.32,17.27 90 top
T1  2908-05WB-MG  [MICRO-SD-SOCKET-PP]  20.95,77.47 270 bottom
TP1  TESTPAD_TPSQB1,27  [TESTPAD_B1,27]  50.55,39.88 0 top
TP2  TESTPAD_TPSQB1,27  [TESTPAD_B1,27]  48.13,36.32 0 top
TP14  TESTPAD_TPSQB1,27  [TESTPAD_B1,27]  55.24,19.05 0 top
TP24  TESTPAD_TPSQB1,27  [TESTPAD_B1,27]  32.38,35.69 0 top
TP25  TESTPAD_TPSQB1,27  [TESTPAD_B1,27]  20.95,40.01 0 top
TP26  TESTPAD_TPSQB1,27  [TESTPAD_B1,27]  37.97,95.25 0 top
TP29  TESTPAD_TPSQB1,27  [TESTPAD_B1,27]  43.43,57.02 0 top
TP31  TESTPAD_TPSQB1,27  [TESTPAD_B1,27]  35.56,33.66 0 top
TP32  TESTPAD_TPSQB1,27  [TESTPAD_B1,27]  4.06,80.14 0 top
U1  AM3354_ZCZ_324  [ZCZ324]  35.56,68.58 0 top
U2  TPD4S012_DRY_6  [DRY6]  66.67,42.93 0 bottom
U3  INA226_DGS_10  [DGS10]  53.59,60.96 180 top
U4  Value  [YZH0016AFAF]  44.2,20.45 0 top
U5  INA226_DGS_10  [DGS10]  59.69,54.1 180 top
U6  TPS51116_PWP_20  [PWP20_3P4X2P4]  11.43,50.67 0 bottom
U7  INA226_DGS_10  [DGS10]  7.75,76.58 180 top
U8  INA226_DGS_10  [DGS10]  7.75,64.26 90 top
U9  AS4C256M16D3B-12BIN  [BGA144C80P9X16_1350X900X120]  17.78,69.85 180 top
U10  TPD4S012_DRY_6  [DRY6]  66.67,60.83 0 bottom
U11  Value  [DRV0006A]  44.07,34.67 0 bottom
U12  TCA9555_RTW_24  [RTW24_2P45X2P45]  30.1,23.75 0 bottom
U13  Value  [DCK0005A_N]  31.75,78.99 270 top
U14  Value  [RHB0032B]  53.34,81.28 90 top
U15  TPS2051B_D_8  [D8]  64.14,43.18 270 top
U16  TPS2051B_D_8  [D8]  64.14,60.96 270 top
U17  TFP410_PAP_64  [PAP64_5X5]  67.18,22.61 0 top
U18  TPD4E004_DRY_6  [DRY6]  22.61,79.5 0 bottom
U19  Value  [D0008A_N]  43.94,83.31 270 top
U34  Value  [RWG0040A]  8.76,40.77 0 bottom
U35  Value  [RLT0007A]  44.2,28.07 0 bottom
U38  Value  [YZH0016AFAF]  49.02,24.51 0 top
U40  Value  [DRV0006A]  44.07,31.62 0 bottom
U41  Value  [DRC0010J]  12.19,20.32 270 bottom
U76  Value  [DDC0006A_N]  9.65,14.86 180 top
U77  TPS3897_DRY_6  [DRY6]  44.96,15.37 0 top
U78  SN74LVC1G11_DCK_6  [DCK6]  48.64,13.72 0 top
U$1  XFL4015-471MEB  [XFL4015-471MEB]  48.39,20.45 180 top
U$2  IRF7821  [SOIC127P600X175-8_V2]  15.88,49.53 0 top
U$3  IRF7832  [SOIC127P600X175-8_V2]  6.99,49.53 0 top
U$4  XFL4020-102MEB  [XFL4020-102MEB]  11.43,54.61 0 top
U$5  ECS-.327-12.5-1210B-N-TR  [OSCCC120X100X35]  28.07,80.14 0 bottom
U$6  NX3225SA-26.000000MHZ-G3  [OSCCC320X250X70]  45.21,60.45 90 bottom
U$7  ECS-250-18-36B-CKY-TR  [OSCCC250X200X65]  52.93,88.19 180 top
U$9  TMP100  [SOT23-6]  37.47,78.49 90 top
U$10  IS21ES16G  [BGA153C50P14X14_1150X1300X100N]  28.57,48.26 0 top
U$11  IS21ES16G  [BGA153C50P14X14_1150X1300X100N]  43.81,48.26 0 top
U$12  PCA9685  [HVQFN28]  46.35,88.27 180 bottom
U$20  DB2441700L  [DB2441700L]  10.54,42.93 180 top
U$21  DB2441700L  [DB2441700L]  6.99,42.93 180 top
U$22  XEL6030-152MEB  [XEL6030-152MEB]  16.64,35.43 180 top
U$25  XEL6030-152MEB  [XEL6030-152MEB]  17.65,26.54 180 top
U$28  XFL4015-471MEB  [XFL4015-471MEB]  39.88,26.8 180 bottom
U$30  XFL4015-471MEB  [XFL4015-471MEB]  50.93,27.69 0 top
U$33  XEL4030-682ME_  [XEL4030-682ME_]  12.57,25.4 90 bottom
X1  J1006F01P  [J1]  66.04,81.28 90 top
X2  USB-A-H  [USB-A-H]  71.12,43.18 180 top
X3  USB-A-H  [USB-A-H]  71.12,60.96 180 top

## Tracks (layer width: path | path; a pad name or v marks a point on that pad's centre or on a via)
!DDR3_CAS  (via drill 0.15)  (2 unrouted)
  Top 0.102: U9.K3 19.81,71.48 v19.81,71.5
  Top 0.152: U1.F1 v28.38,71.76
!DDR3_CS  (via drill 0.15)  (2 unrouted)
  Top 0.152: U1.H2 v29.18,70.16
!DDR3_RAS  (via drill 0.15)  (2 unrouted)
  Top 0.102: U9.J3 19.74,70.61 v19.81,70.61
  Top 0.152: U1.G4 v30.78,70.96
!DDR3_RESET  (via drill 0.15)  (1 unrouted)
  Top 0.152: U1.G2 v29.18,70.96
!DDR3_WE  (via drill 0.15)  (2 unrouted)
  Top 0.152: U1.B2 v29.18,74.96
!ETH_INT  (via drill 0.2)
  Top 0.152: U14.8 55.64,78.88 v55.68,78.84 | v55.68,78.84 55.61,78.73 55.38,78.88 55.64,78.96 v55.68,78.84
  Route3 0.152: v59.94,16.38 56.01,12.45 52.7,12.45 51.18,10.92 40.01,10.92 39.12,11.81 39.12,19.94 40.13,20.95 40.13,22.48 38.73,23.88 36.58,23.88 35.94,24.51 v34.16,24.51 | v34.16,24.51 34.22,24.62 34.46,24.51 34.22,24.4 v34.16,24.51 | v59.94,16.38 59.99,16.27 59.73,16.17 59.83,16.43 v59.94,16.38
  Route14 0.152: v55.68,78.84 56.13,78.38 56.13,72.26 57.28,71.12 57.28,65.91 66.17,57.02 v66.17,54.61 | v66.17,54.61 66.17,50.24 66.63,49.77 66.63,47.63 66.17,47.17 66.17,45.09 65.66,44.58 65.66,43.49 64.26,42.09 64.26,31.75 61.72,29.21 61.72,18.16 v59.94,16.38 | v55.68,78.84 55.79,78.89 55.89,78.63 55.63,78.72 v55.68,78.84 | v59.94,16.38 59.9,16.5 60.16,16.59 60.06,16.34 v59.94,16.38 | v66.17,54.61 66.05,54.66 66.17,54.91 66.28,54.66 v66.17,54.61 | v66.17,54.61 66.28,54.56 66.17,54.31 66.05,54.56 v66.17,54.61
  Bottom 0.152: U12.2 v34.15,24.5 v34.16,24.51 | R90.2 v66.17,54.61 | v34.16,24.51 34.12,24.39 33.86,24.5 34.11,24.62 v34.16,24.51 | v66.17,54.61 66.22,54.72 66.47,54.61 66.22,54.5 v66.17,54.61
!ETH_RESET  (via drill 0.2)
  Top 0.152: U14.18 54.59,84.3 v54.56,84.33 | v54.56,84.33 54.68,84.29 54.59,84.03 54.45,84.26 v54.56,84.33
  Route3 0.152: v33.66,24 35.81,24 36.32,23.5 37.85,23.5 38.48,23.5 39.75,22.23 39.75,21.08 38.73,20.07 38.73,11.68 39.88,10.54 40.41,10.54 40.46,10.59 50.98,10.59 51.03,10.54 51.56,10.54 53.09,12.07 56.26,12.07 v60.71,16.51 | v33.66,24 33.71,24.12 33.95,24 33.71,23.89 v33.66,24 | v60.71,16.51 60.75,16.39 60.49,16.3 60.59,16.55 v60.71,16.51
  Route14 0.152: v60.71,16.51 62.1,17.91 62.1,28.96 64.64,31.5 64.64,35.95 64.57,36.02 64.57,36.32 64.64,36.39 64.64,40.26 66.04,41.66 66.04,44.32 66.55,44.83 66.55,46.99 67.06,47.5 67.06,49.91 66.55,50.42 v66.55,53.34 | v66.55,53.34 66.55,57.15 57.66,66.04 57.66,71.25 56.52,72.39 56.52,78.87 54.61,80.77 54.61,84.28 v54.56,84.33 | v54.56,84.33 54.68,84.3 54.61,84.03 54.46,84.26 v54.56,84.33 | v60.71,16.51 60.66,16.63 60.92,16.72 60.82,16.47 v60.71,16.51 | v66.55,53.34 66.66,53.29 66.55,53.04 66.43,53.29 v66.55,53.34 | v66.55,53.34 66.43,53.39 66.55,53.64 66.66,53.39 v66.55,53.34
  Bottom 0.152: U12.3 v33.66,24 | R91.2 v66.55,53.34 | v33.66,24 33.6,23.89 33.35,24 33.6,24.12 v33.66,24 | v66.55,53.34 66.6,53.45 66.85,53.34 66.6,53.23 v66.55,53.34
!JTAG_TRST  (via drill 0.15, 0.2, 0.3)
  Top 0.152: v36.34,74.96 U1.B10 | U78.6 49.62,15.08 v49.66,15.11 | R57.1 JP1.2 | v66.17,90.42 58.17,90.42 55.5,93.09 v38.86,93.09 | v36.34,74.96 36.37,74.86 36.18,74.8 36.24,74.99 v36.34,74.96 | v49.66,15.11 49.76,15.05 49.62,14.81 49.54,15.08 v49.66,15.11 | v66.17,90.42 66.1,90.26 65.72,90.42 66.1,90.59 v66.17,90.42 | v38.86,93.09 38.93,93.25 39.31,93.09 38.93,92.93 v38.86,93.09
  Route3 0.152: v36.34,74.96 36.24,75.06 35.78,75.06 35.15,75.68 35.15,76.73 32.77,79.11 32.77,81.41 32,82.17 32,92.46 JP1.2 | v36.34,74.96 36.26,74.9 36.13,75.06 36.34,75.06 v36.34,74.96
  Bottom 0.152: v49.66,15.11 50.55,14.22 51.18,14.22 51.56,13.84 52.07,13.34 52.07,11.05 52.07,10.54 52.32,10.29 52.45,10.16 52.7,10.16 52.96,10.16 53.34,9.78 53.34,9.27 53.72,8.89 61.85,8.89 62.48,9.53 74.42,9.53 75.82,10.92 75.82,22.86 76.58,23.62 76.58,41.53 74.17,43.94 74.17,70.36 76.2,72.39 76.2,77.85 66.17,87.88 v66.17,90.42 | v38.86,93.09 37.72,91.95 32.51,91.95 JP1.2 | v49.66,15.11 49.77,15.16 49.87,14.9 49.61,15 v49.66,15.11 | v66.17,90.42 66.33,90.36 66.17,89.97 66,90.36 v66.17,90.42 | v38.86,93.09 38.93,92.93 38.54,92.77 38.7,93.16 v38.86,93.09
!MGMT_INT0  (via drill 0.2)
  Top 0.152: R94.2 J1.B26 v38.1,10.16 | v38.1,10.16 38.14,10.04 37.89,9.95 37.98,10.2 v38.1,10.16
  Bottom 0.152: U12.7 31.35,21.36 33.34,19.37 35.88,19.37 36.83,18.41 36.83,15.24 38.1,13.97 v38.1,10.16 | J1.B26 v38.1,10.16 | v38.1,10.16 37.99,10.21 38.1,10.46 38.21,10.21 v38.1,10.16 | v38.1,10.16 38.14,10.04 37.89,9.95 37.98,10.2 v38.1,10.16
!MGMT_INT1  (via drill 0.2)
  Top 0.152: R95.2 J1.B25 v36.83,10.16 | v36.83,10.16 36.87,10.04 36.62,9.95 36.71,10.2 v36.83,10.16
  Bottom 0.152: U12.8 30.85,21.4 33.33,18.92 35.56,18.92 36.32,18.16 36.32,15.11 36.83,14.61 v36.83,10.16 | J1.B25 v36.83,10.16 | v36.83,10.16 36.72,10.21 36.83,10.46 36.94,10.21 v36.83,10.16 | v36.83,10.16 36.87,10.04 36.62,9.95 36.71,10.2 v36.83,10.16
!MMC1_RESET  (via drill 0.15, 0.2)
  Top 0.102: U$10.K5 26.9,47.01 v26.8,47.12 | v26.8,47.12 26.91,47.17 27,47.01 26.81,46.99 v26.8,47.12
  Route3 0.152: v28.32,20.83 29.34,21.84 31.75,21.84 32.13,22.23 32.13,27.43 33.02,28.32 33.02,43.18 30.35,45.85 28.7,45.85 28.32,46.23 28.32,46.61 27.81,47.12 v26.8,47.12 | v26.8,47.12 26.84,47.21 27.02,47.12 26.84,47.03 v26.8,47.12 | v28.32,20.83 28.28,20.95 28.53,21.04 28.44,20.79 v28.32,20.83
  Bottom 0.152: U12.12 28.85,21.36 v28.32,20.83 | R97.2 28.11,20.62 | 28.11,20.62 v28.32,20.83 | v28.32,20.83 28.28,20.95 28.53,21.04 28.44,20.79 v28.32,20.83 | 28.11,20.62 28.36,20.71 v28.32,20.83 | 28.11,20.62 28.2,20.87 v28.32,20.83
!MMC2_RESET  (via drill 0.15, 0.2)
  Top 0.102: U$11.K5 42.55,46.99 v42.04,46.99 | v42.04,46.99 42.11,47.09 42.26,46.99 42.11,46.89 v42.04,46.99
  Route3 0.152: v28.96,20.7 29.59,21.34 32,21.34 32.64,21.97 32.64,27.05 35.18,29.59 35.18,36.83 39.12,40.77 39.12,42.16 40.64,43.69 40.64,45.59 v42.04,46.99 | v42.04,46.99 42.07,46.9 41.88,46.83 41.94,47.02 v42.04,46.99 | v28.96,20.7 28.91,20.82 29.17,20.91 29.07,20.66 v28.96,20.7
  Bottom 0.152: U12.11 29.35,21.09 v28.96,20.7 | R96.2 29.17,20.49 | 29.17,20.49 v28.96,20.7 | v28.96,20.7 28.91,20.82 29.17,20.91 29.07,20.66 v28.96,20.7 | 29.17,20.49 29.07,20.74 v28.96,20.7 | 29.17,20.49 28.91,20.58 v28.96,20.7
!NMI  (via drill 0.15, 0.3)
  Top 0.203: U1.B18 v42.74,74.96 | v42.74,74.96 42.77,74.89 42.58,74.8 42.67,74.99 v42.74,74.96
  Top 0.254: v30.73,26.67 31.05,26.35 31.16,26.25 33.27,26.25 33.91,25.61 R55.1 | v30.73,26.67 30.84,26.73 31.05,26.35 30.67,26.56 v30.73,26.67
  Route3 0.203: v42.74,74.96 43.18,75.4 43.18,76.58 42.42,77.34 42.42,80.39 41.78,81.03 41.78,81.66 40.9,82.55 39.85,82.55 39.59,82.3 v38.99,82.3 | v42.74,74.96 42.7,75.02 42.9,75.11 42.8,74.92 v42.74,74.96 | v38.99,82.3 39.04,82.44 39.44,82.3 39.04,82.16 v38.99,82.3
  Route13 0.203: v30.73,26.67 30.73,27.69 31.24,28.19 33.4,28.19 35.18,29.97 35.18,32.26 35.18,41.15 34.8,41.53 34.8,46.74 34.16,47.37 34.16,58.8 35.43,60.07 35.43,61.59 35.94,62.1 35.94,71.9 36.22,72.18 36.49,72.18 36.76,72.44 36.76,76.45 36.76,80.06 v38.99,82.3 | v30.73,26.67 30.59,26.72 30.73,27.12 30.88,26.72 v30.73,26.67 | v38.99,82.3 39.05,82.16 38.67,81.98 38.85,82.36 v38.99,82.3
  Bottom 0.254: U12.22 30.35,26.29 v30.73,26.67 | v30.73,26.67 30.79,26.56 30.42,26.35 30.62,26.73 v30.73,26.67
!PWM_OE  (via drill 0.3)